# Altium project UltraZohm_Digital_Sensor_Board.PrjPcb (part 1 of 3)
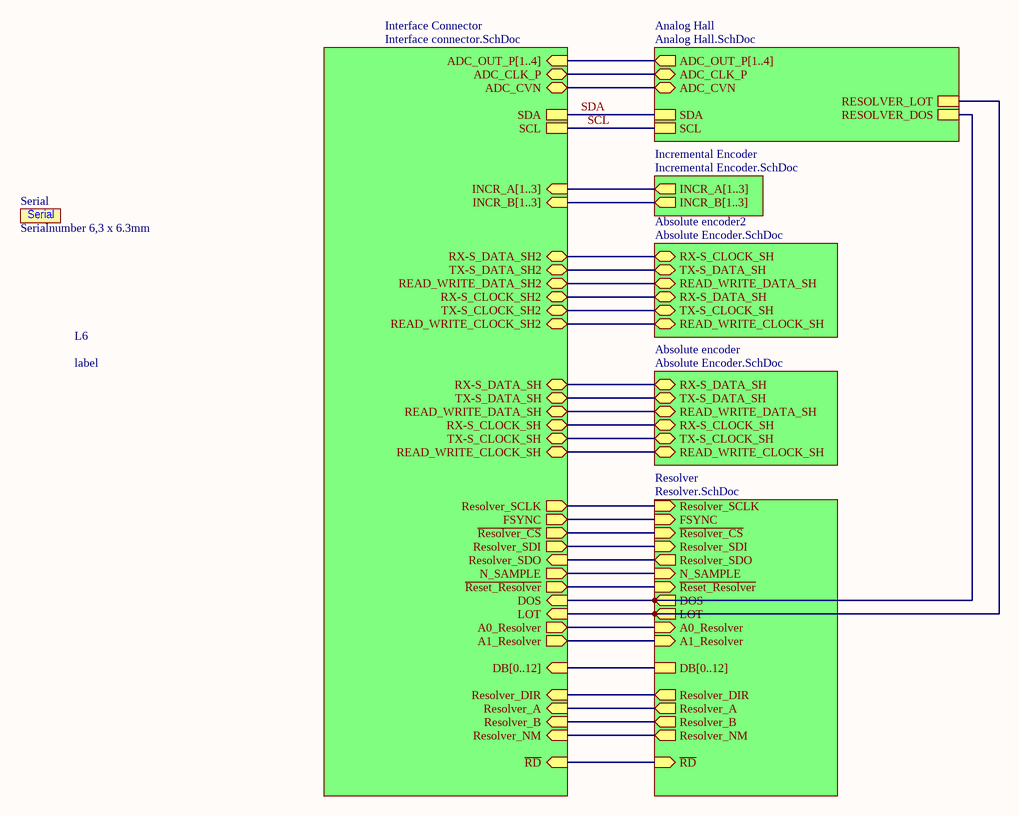
[diagram p0: TopSheet.SchDoc]
ProjectRevision: 2v00; ProjectName: Universal Encoder; Date: 01/12/21; AuthorParam: Julian Klein
16 sheets, 525 parts. Net scope: hierarchical (ports join the sheet entries above them; power ports are global).
Board file: UltraZohm_Digital_Sensor_Board_v1.01.PcbDoc
Sheets:
  TopSheet.SchDoc
    Analog Hall = Analog Hall.SchDoc
      ADC1 = ADC_AH.SchDoc
      ADC2 = ADC_AH.SchDoc
      ADC3 = ADC_AH.SchDoc
      ADC4 = ADC_AH.SchDoc
      Power_Analog Hall = Power Supplies.SchDoc
      GAIN1 = I2CInterface.SchDoc
      GAIN2 = I2CInterface.SchDoc
    Interface Connector = Interface connector.SchDoc
      GF = Goldfinger_Connector.SchDoc
      BS = Busswitch.SchDoc
        Busswitch_B = Busswitch_B.SchDoc
        Busswitch_A = Busswitch_A.SchDoc
        BusswitchControl = I2CInterface.SchDoc
    Absolute encoder = Absolute Encoder.SchDoc
    Resolver = Resolver.SchDoc
      Buffer_EXC = Buffer_EXC.SchDoc
      Impedance Converter = Impedance converter.SchDoc
    Incremental Encoder = Incremental Encoder.SchDoc
      Incre2 = Input Mode Selector.SchDoc
      Incre1 = Input Mode Selector.SchDoc
    Absolute encoder2 = Absolute Encoder.SchDoc

## Sheet TopSheet.SchDoc
size A4; Author: Julian Klein; CompanyName: Technische Hochschule Nürnberg Georg Simon Ohm; Organization: UltraZohm; Address1: Kesslerplatz 12; Address2: 90489 Nürnberg; Address3: GERMANY; DocumentNumber: 1; SheetNumber: 1; SheetTotal: 12; Website: www.ultrazohm.com

### Parts
L6  label  [revisioninfo]
Serial  Serialnumber 6,3 x 6.3mm  [Serial_6.3x6.3mm]  (no BOM)

### Sub-sheets
Absolute encoder = Absolute Encoder.SchDoc: TX-S_DATA_SH (bidir), READ_WRITE_DATA_SH (bidir), RX-S_CLOCK_SH (bidir), RX-S_DATA_SH (bidir), TX-S_CLOCK_SH (bidir), READ_WRITE_CLOCK_SH (bidir)
Absolute encoder2 = Absolute Encoder.SchDoc: TX-S_DATA_SH (bidir), READ_WRITE_DATA_SH (bidir), RX-S_CLOCK_SH (bidir), RX-S_DATA_SH (bidir), TX-S_CLOCK_SH (bidir), READ_WRITE_CLOCK_SH (bidir)
Analog Hall = Analog Hall.SchDoc: ADC_OUT_P[1..4] (out), ADC_CLK_P (bidir), ADC_CVN (bidir), SCL, SDA, RESOLVER_LOT, RESOLVER_DOS
Incremental Encoder = Incremental Encoder.SchDoc: INCR_B[1..3] (out), INCR_A[1..3] (out)
Interface Connector = Interface connector.SchDoc: ADC_CLK_P (bidir), ADC_OUT_P[1..4] (in), ADC_CVN (bidir), TX-S_DATA_SH (bidir), READ_WRITE_DATA_SH (bidir), RX-S_CLOCK_SH (bidir), RX-S_DATA_SH (bidir), TX-S_CLOCK_SH (bidir), READ_WRITE_CLOCK_SH (bidir), INCR_B[1..3] (in), INCR_A[1..3] (in), N_SAMPLE (out), Resolver_SDO (in), Resolver_SDI (out), FSYNC (out), Resolver_SCLK (out), ~{Reset_Resolver} (out), DOS (in), LOT (in), A0_Resolver (out), A1_Resolver (out), Resolver_B (in), Resolver_DIR (in), Resolver_NM (in), Resolver_A (in), ~{Resolver_CS} (out), DB[0..12] (in), READ_WRITE_CLOCK_SH2 (bidir), RX-S_DATA_SH2 (bidir), READ_WRITE_DATA_SH2 (bidir), TX-S_DATA_SH2 (bidir), RX-S_CLOCK_SH2 (bidir), TX-S_CLOCK_SH2 (bidir), SDA, SCL, ~{RD} (in)
Resolver = Resolver.SchDoc: N_SAMPLE (in), Resolver_SDO (out), Resolver_SDI (in), FSYNC (in), Resolver_SCLK (in), ~{Reset_Resolver} (in), DOS (out), LOT (out), A1_Resolver (in), A0_Resolver (in), ~{Resolver_CS} (in), Resolver_B (out), Resolver_DIR (out), Resolver_NM (out), Resolver_A (out), DB[0..12], ~{RD} (in)

### Nets
~{RD}: sheet Interface Connector/~{RD}, sheet Resolver/~{RD}
~{Reset_Resolver}: sheet Interface Connector/~{Reset_Resolver}, sheet Resolver/~{Reset_Resolver}
~{Resolver_CS}: sheet Interface Connector/~{Resolver_CS}, sheet Resolver/~{Resolver_CS}
A: sheet Interface Connector/Resolver_A, sheet Resolver/Resolver_A
ADC_CLK: sheet Analog Hall/ADC_CLK_P, sheet Interface Connector/ADC_CLK_P
ADC_CVN: sheet Analog Hall/ADC_CVN, sheet Interface Connector/ADC_CVN
B: sheet Interface Connector/Resolver_B, sheet Resolver/Resolver_B
DIG_IO_11: sheet Interface Connector/FSYNC, sheet Resolver/FSYNC
DIG_IO_12: sheet Interface Connector/N_SAMPLE, sheet Resolver/N_SAMPLE
DIG_IO_14: sheet Interface Connector/A1_Resolver, sheet Resolver/A1_Resolver
DIG_IO_15: sheet Interface Connector/A0_Resolver, sheet Resolver/A0_Resolver
DIR: sheet Interface Connector/Resolver_DIR, sheet Resolver/Resolver_DIR
DOS: sheet Analog Hall/RESOLVER_DOS, sheet Interface Connector/DOS, sheet Resolver/DOS
LOT: sheet Analog Hall/RESOLVER_LOT, sheet Interface Connector/LOT, sheet Resolver/LOT
NM: sheet Interface Connector/Resolver_NM, sheet Resolver/Resolver_NM
READ_WRITE_CLOCK_SH: sheet Interface Connector/READ_WRITE_CLOCK_SH, sheet Absolute encoder/READ_WRITE_CLOCK_SH
READ_WRITE_DATA_SH: sheet Interface Connector/READ_WRITE_DATA_SH, sheet Absolute encoder/READ_WRITE_DATA_SH
Resolver_SCLK: sheet Interface Connector/Resolver_SCLK, sheet Resolver/Resolver_SCLK
Resolver_SDI: sheet Interface Connector/Resolver_SDI, sheet Resolver/Resolver_SDI
Resolver_SDO: sheet Interface Connector/Resolver_SDO, sheet Resolver/Resolver_SDO
RX-S_CLOCK_SH: sheet Interface Connector/RX-S_CLOCK_SH, sheet Absolute encoder/RX-S_CLOCK_SH
RX-S_DATA_SH: sheet Interface Connector/RX-S_DATA_SH, sheet Absolute encoder/RX-S_DATA_SH
SCL: sheet Analog Hall/SCL, sheet Interface Connector/SCL
SDA: sheet Analog Hall/SDA, sheet Interface Connector/SDA
TX-S_CLOCK_SH: sheet Interface Connector/TX-S_CLOCK_SH, sheet Absolute encoder/TX-S_CLOCK_SH
TX-S_DATA_SH: sheet Interface Connector/TX-S_DATA_SH, sheet Absolute encoder/TX-S_DATA_SH
NetMUX1_3: sheet Interface Connector/RX-S_DATA_SH2, sheet Absolute encoder2/RX-S_CLOCK_SH
NetMUX1_5: sheet Interface Connector/TX-S_DATA_SH2, sheet Absolute encoder2/TX-S_DATA_SH
NetMUX1_7: sheet Interface Connector/READ_WRITE_DATA_SH2, sheet Absolute encoder2/READ_WRITE_DATA_SH
NetMUX1_10: sheet Interface Connector/RX-S_CLOCK_SH2, sheet Absolute encoder2/RX-S_DATA_SH
NetMUX1_12: sheet Interface Connector/TX-S_CLOCK_SH2, sheet Absolute encoder2/TX-S_CLOCK_SH
NetMUX1_14: sheet Interface Connector/READ_WRITE_CLOCK_SH2, sheet Absolute encoder2/READ_WRITE_CLOCK_SH

### Buses and harness runs
bus sheet Analog Hall/ADC_OUT_P[1..4] = sheet Interface Connector/ADC_OUT_P[1..4]
bus sheet Incremental Encoder/INCR_A[1..3] = sheet Interface Connector/INCR_A[1..3]
bus sheet Incremental Encoder/INCR_B[1..3] = sheet Interface Connector/INCR_B[1..3]
bus sheet Interface Connector/DB[0..12] = sheet Resolver/DB[0..12]

### Notes on the sheet
- Title
- Revision:
- Design Engineer:
- Date:
- Project:
- Sheet
- of

### Library data of the parts
Serial = SerialNumber: Created: 2018_09_18_AGeiger; Value: Serialnumber 6,3 x 6.3mm

## Sheet Analog Hall.SchDoc
size A4; Author: Julian Klein; CompanyName: Technische Hochschule Nürnberg Georg Simon Ohm; Organization: UltraZohm; Address1: Kesslerplatz 12; Address2: 90489 Nürnberg; Address3: GERMANY; DocumentNumber: 3; SheetNumber: 3; SheetTotal: 12; Website: www.ultrazohm.com
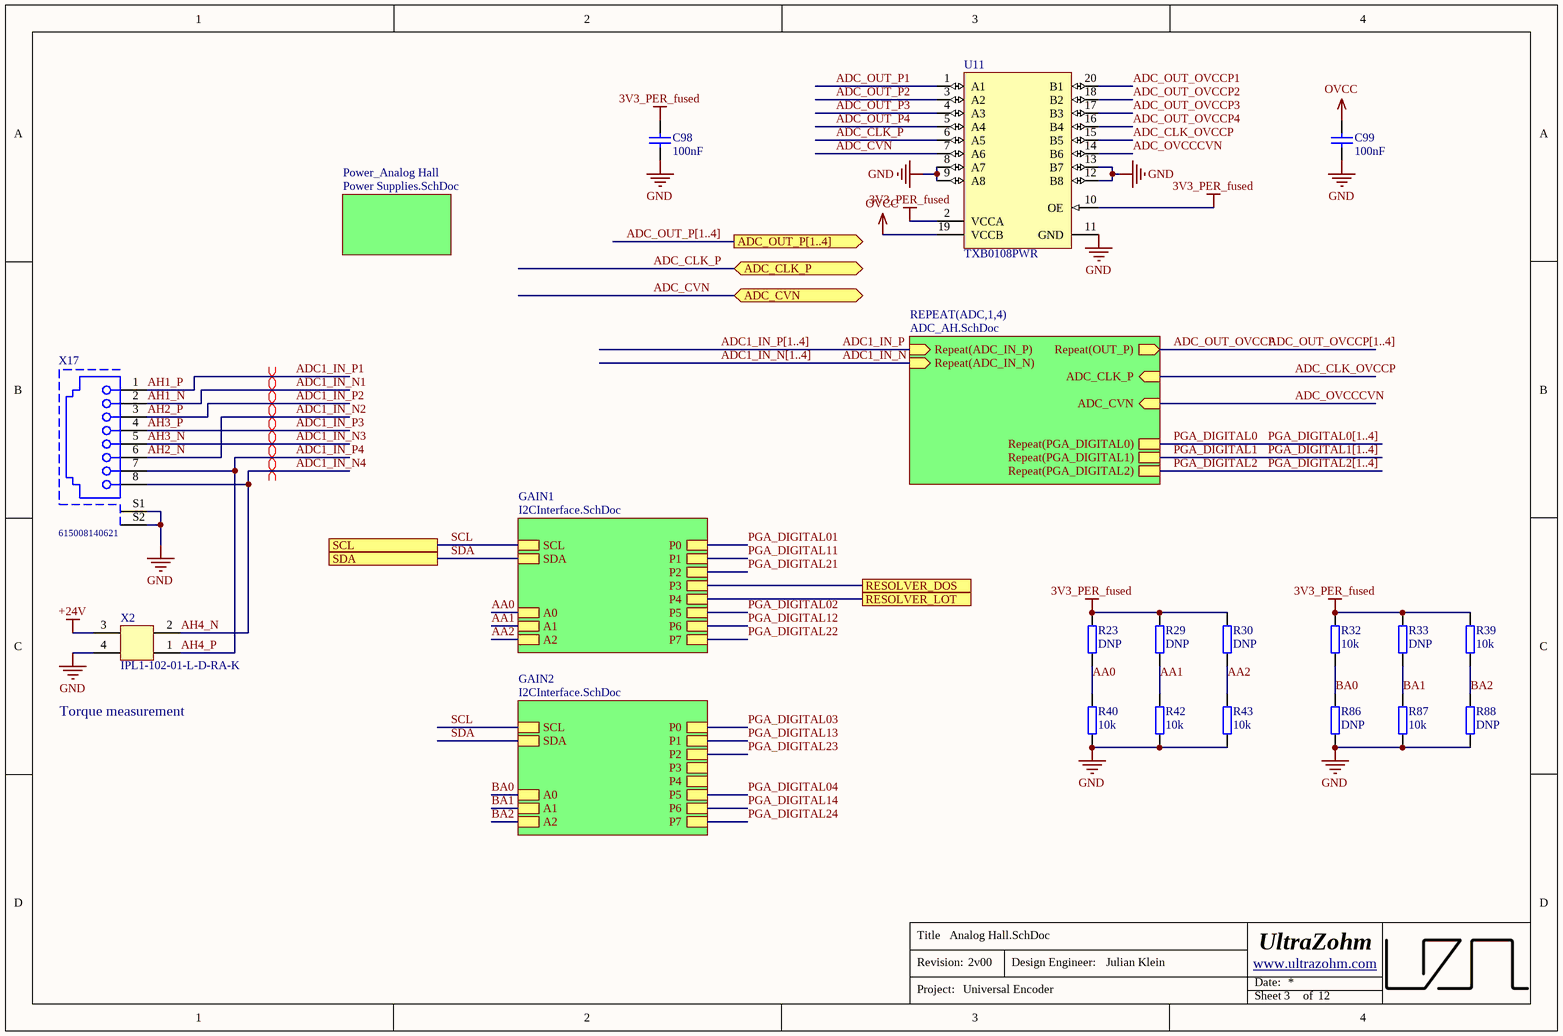
[diagram p1: Analog Hall.SchDoc]

### Parts
C98  100nF  [CAPC1608X07N]
C99  100nF  [CAPC1608X07N]
R23  DNP  [RESC1608X06N]
R29  DNP  [RESC1608X06N]
R30  DNP  [RESC1608X06N]
R32  10k  [RESC1608X06N]
R33  DNP  [RESC1608X06N]
R39  10k  [RESC1608X06N]
R40  10k  [RESC1608X06N]
R42  10k  [RESC1608X06N]
R43  10k  [RESC1608X06N]
R86  DNP  [RESC1608X06N]
R87  10k  [RESC1608X06N]
R88  DNP  [RESC1608X06N]
U11  TXB0108PWR  [PW0020A_L]
X2  IPL1-102-01-L-D-RA-K  [Conector 2x2 TH Horizontal]
X17  615008140621  [615008140621]

### Sub-sheets
GAIN1 = I2CInterface.SchDoc: P4, P7, SDA, P2, P1, A1, A2, P3, P6, SCL, A0, P0, P5
GAIN2 = I2CInterface.SchDoc: P4, P7, SDA, P2, P1, A1, A2, P3, P6, SCL, A0, P0, P5
Power_Analog Hall = Power Supplies.SchDoc: no entries
REPEAT(ADC,1,4) = ADC_AH.SchDoc: Repeat(ADC_IN_N) (in), Repeat(ADC_IN_P) (in), Repeat(OUT_P) (out), ADC_CLK_P (in), ADC_CVN (in), Repeat(PGA_DIGITAL0), Repeat(PGA_DIGITAL1), Repeat(PGA_DIGITAL2)

### Ports
ADC_CLK_P (bidir), ADC_CVN (bidir), ADC_OUT_P[1..4] (out), RESOLVER_DOS, RESOLVER_LOT, SCL, SDA

### Nets
3V3_PER_fused: C98.1 R23.2 R29.2 R30.2 R32.1 R33.1 R39.1 U11.2(VCCA) U11.10(OE)
+24V: X2.3
GND: C98.2 C99.2 R40.1 R42.1 R43.1 R86.2 R87.2 R88.2 U11.8(A7) U11.9(A8) U11.11(GND) U11.12(B8) U11.13(B7) X2.4 X17.S1 X17.S2
OVCC: C99.1 U11.19(VCCB)
AA0: R23.1 R40.2 ; sheet GAIN1/A0  [project net A0]
AA1: R29.1 R42.2 ; sheet GAIN1/A1  [project net A1]
AA2: R30.1 R43.2 ; sheet GAIN1/A2  [project net A2]
ADC1_IN_N: sheet REPEAT(ADC,1,4)/Repeat(ADC_IN_N)
ADC1_IN_N1: X17.2  [also labelled AH1_N]
ADC1_IN_N2: X17.6  [also labelled AH2_N]
ADC1_IN_N3: X17.5  [also labelled AH3_N]
ADC1_IN_N4: X2.2 X17.8  [also labelled AH4_N]
ADC1_IN_P: sheet REPEAT(ADC,1,4)/Repeat(ADC_IN_P)
ADC1_IN_P1: X17.1  [also labelled AH1_P]
ADC1_IN_P2: X17.3  [also labelled AH2_P]
ADC1_IN_P3: X17.4  [also labelled AH3_P]
ADC1_IN_P4: X2.1 X17.7  [also labelled AH4_P]
ADC_CLK_OVCCP: U11.15(B5) ; sheet REPEAT(ADC,1,4)/ADC_CLK_P
ADC_CLK_P: U11.6(A5) ; port ADC_CLK_P  [project net ADC_CLK]
ADC_CVN: U11.7(A6) ; port ADC_CVN
ADC_OUT_OVCCP: sheet REPEAT(ADC,1,4)/Repeat(OUT_P)
ADC_OUT_OVCCP1: U11.20(B1)
ADC_OUT_OVCCP2: U11.18(B2)
ADC_OUT_OVCCP3: U11.17(B3)
ADC_OUT_OVCCP4: U11.16(B4)
ADC_OUT_P1: U11.1(A1)
ADC_OUT_P2: U11.3(A2)
ADC_OUT_P3: U11.4(A3)
ADC_OUT_P4: U11.5(A4)
ADC_OVCCCVN: U11.14(B6) ; sheet REPEAT(ADC,1,4)/ADC_CVN  [project net ADC_CVN]
BA0: R32.2 R86.1 ; sheet GAIN2/A0  [project net A0]
BA1: R33.2 R87.1 ; sheet GAIN2/A1  [project net A1]
BA2: R39.2 R88.1 ; sheet GAIN2/A2  [project net A2]
DOS: port RESOLVER_DOS, sheet GAIN1/P3
LOT: port RESOLVER_LOT, sheet GAIN1/P4
PGA_DIGITAL0: sheet REPEAT(ADC,1,4)/Repeat(PGA_DIGITAL0)
PGA_DIGITAL1: sheet REPEAT(ADC,1,4)/Repeat(PGA_DIGITAL1)
PGA_DIGITAL2: sheet REPEAT(ADC,1,4)/Repeat(PGA_DIGITAL2)
SCL: port SCL, sheet GAIN1/SCL, sheet GAIN2/SCL
SDA: port SDA, sheet GAIN1/SDA, sheet GAIN2/SDA

### Buses and harness runs
bus ADC1_IN_N[1..4]
bus ADC1_IN_P[1..4]
bus ADC_OUT_OVCCP[1..4]
bus ADC_OUT_P[1..4] = port ADC_OUT_P[1..4]
bus PGA_DIGITAL0[1..4]
bus PGA_DIGITAL1[1..4]
bus PGA_DIGITAL2[1..4]

### Layout directives
differential pair: ADC1_IN_N1, ADC1_IN_N2, ADC1_IN_N3, ADC1_IN_N4, ADC1_IN_P1, ADC1_IN_P2, ADC1_IN_P3, ADC1_IN_P4

### Notes on the sheet
- (near X2) Torque measurement
- Title
- Revision:
- Design Engineer:
- Date:
- Project:
- Sheet
- of

### Library data of the parts
C98 = Cap_0603: MPN: 885012206071; MF: Würth; Voltage: 25V; Value: 100nF; Supplier 1: Mouser; Supplier 2: *; Supplier Part Number 1: 710-885012206071; Supplier Part Number 2: *
C99 = Cap_0603: MPN: 885012206071; MF: Würth; Voltage: 16V; Value: 100nF; Supplier 1: Mouser; Supplier 2: *; Supplier Part Number 1: 710-885012206071; Supplier Part Number 2: *
R23 R29 R30 R32 R33 R39 R40 R42 R43 R86-R88 = R_0603: MPN: CRCW06030000Z0EAC; MF: Vishay; Supplier 1: Mouser; Supplier Part Number 1: 71-CRCW06030000Z0EAC
  R23 R29 R30 R33 R86 R88: Value: DNP
  R32 R39 R40 R42 R43 R87: Value: 10k
U11 = CMP-2000-07337-1: TXB0108 8-Bit Bidirectional Voltage-Level Translator with Auto-Direction Sensing and / +/- 15-kV ESD Protection, 1.2 to 3.6 V, -40 to 85 degC, 20-Pin TSSOP (PW), Green (RoHS & no Sb/Br), Tape and Reel; Manufacturer: Texas Instruments; Propagation Delay (Max): 4ns; Logic Function: Translator,Bidirectional; Input Type: Logic; Package Version: 4040064-5/G, 02/2011; Voltage - Supply: 1.2V~3.6V,1.65V~5.5V; Data Rate: 100Mbps; Other Names: 296-21527-6; Number of Channels: 8; Differential - Input: Output:No/No; Number of Outputs/Channel: 1; Product Training Modules: VoltageLevelTranslation; Dynamic Catalog: TXBSeries; Package Reference: PW20; Package Description: 20-Pin Small Outline Package Integrated Circuit, Body 6.5 x 4.4 mm, Pitch 0.65 mm; Category: IntegratedCircuits(ICs); Datasheet URL: http://www.ti.com/general/docs/lit/getliterature.tsp?genericPartNumber=TXB0108&fileType=pdf; Package / Case: 20-TSSOP(0.173",4.40mmWidth); Family: Logic-Translators; Standard Package: 1; Series: -; Manufacturer URL: http://www.ti.com/; Number of Bits: 8; Package URL: http://www.ti.com/litv/pdf/mpds362; Output Type: Logic; Datasheet Version: Rev. F, 12/2014; Packaging: Digi-Reel®; Operating Temperature: -40°C~85°C; Supplier Device Package: 20-TSSOP; Mounting Technology: SurfaceMount
X2 = Conector 2x2 Horizontal: CONN HEADER R/A 4 POS 2.54MM Through Hole; MF: Samtec; Supplier Part Number 2: SAM8823-ND; MPN: IPL1-102-01-L-D-RA-K; Supplier Part Number 1: 200-IPL110201LDRAK; Supplier 1: Mouser; Supplier 2: Digi-Key
X17 = 615008140621: Modular Jack WR-MJ, Tab Up, Shielded, with EMI Panel Finger, Horizontal Entry, THT, 8P8C; Working Voltage: 120VAC; MF: Wurth Elektronik; Compliance: Leadfree/RoHS; Contact Resistance: 20mOhm; Rated Current: 1.5A; Withstanding Voltage: 1000VAC; Port: 1x1; Entrance: Horizontal; Manufacturer URL: http://www.we-online.de; MPN: 615008140621; Mounting Technology: THT; Operating Temperature: -40to85degC; Packaging: Tray; Pin Number: 8P8C; Package Reference: 615008140621; Datasheet URL: https://katalog.we-online.de/em/datasheet/615008140621.pdf; Publisher: WurthElektronik; Supplier Part Number 1: 710-615008140621; Supplier Part Number 2: 732-2742-ND; Supplier 1: Mouser; Supplier 2: Digi-Key

## Sheet ADC_AH.SchDoc
size A4; Author: Julian Klein; CompanyName: Technische Hochschule Nürnberg Georg Simon Ohm; Organization: UltraZohm; Address1: Kesslerplatz 12; Address2: 90489 Nürnberg; Address3: GERMANY; DocumentNumber: 4; SheetNumber: 4; SheetTotal: 12; Website: www.ultrazohm.com
Used 4 times, as channels Analog Hall/ADC1, Analog Hall/ADC2, Analog Hall/ADC3, Analog Hall/ADC4. Parts and nets are listed once, with the designators drawn on the sheet.
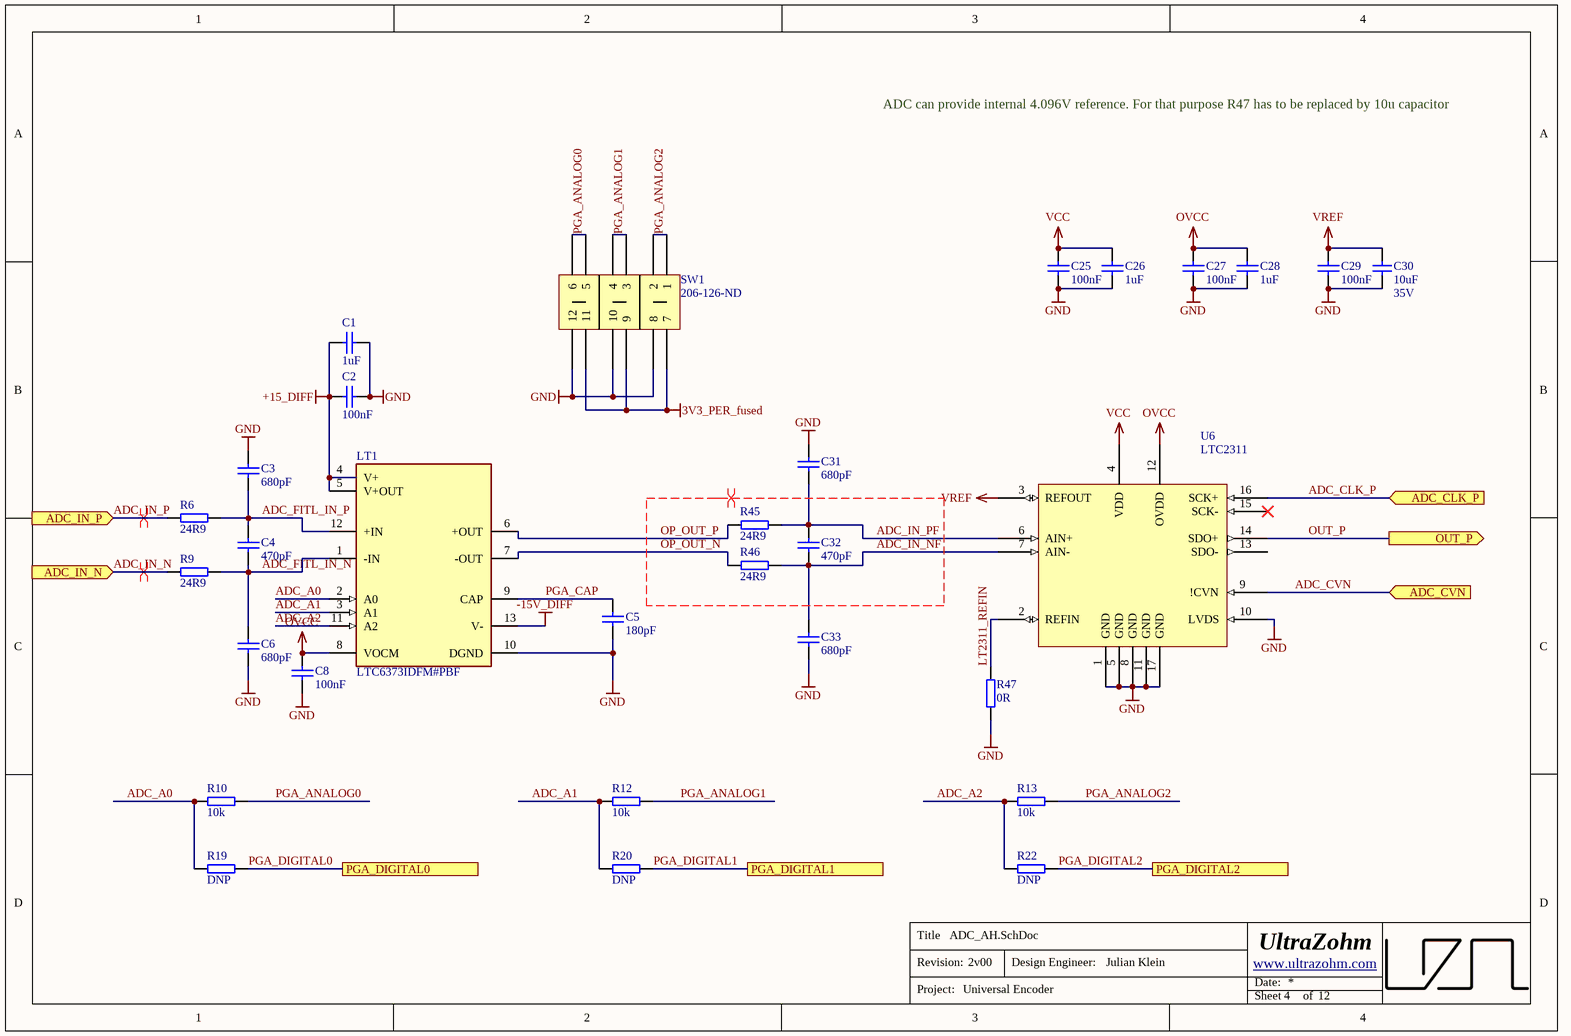
[diagram p2: ADC_AH.SchDoc]

### Parts
C1  1uF  [CAPC1608X07N]
C2  100nF  [CAPC1608X07N]
C3  680pF  [CAPC1608X07N]
C4  470pF  [CAPC1608X07N]
C5  180pF  [CAPC1608X07N]
C6  680pF  [CAPC1608X07N]
C8  100nF  [CAPC1608X07N]
C25  100nF  [CAPC1608X07N]
C26  1uF  [CAPC1608X07N]
C27  100nF  [CAPC1608X07N]
C28  1uF  [CAPC1608X07N]
C29  100nF  [CAPC1608X07N]
C30  10uF  Voltage: 35V  [C_1206]
C31  680pF  [CAPC1608X07N]
C32  470pF  [CAPC1608X07N]
C33  680pF  [CAPC1608X07N]
LT1  LTC6373IDFM#PBF  [FP-LTC6373IDFM#PBF-MFG]
R6  24R9  [RESC1608X06N]
R9  24R9  [RESC1608X06N]
R10  10k  [RESC1608X06N]
R12  10k  [RESC1608X06N]
R13  10k  [RESC1608X06N]
R19  DNP  [RESC1608X06N]
R20  DNP  [RESC1608X06N]
R22  DNP  [RESC1608X06N]
R45  24R9  [RESC1608X06N]
R46  24R9  [RESC1608X06N]
R47  0R  [RESC1608X06N]
SW1  Supplier Part Number 1: 206-126-ND  [206-123]  (hidden comment: 206-126)
U6  LTC2311  [LTC2311-16]

### Ports
ADC_CLK_P (in), ADC_CVN (in), ADC_IN_N (in), ADC_IN_P (in), OUT_P (out), PGA_DIGITAL0, PGA_DIGITAL1, PGA_DIGITAL2

### Nets
3V3_PER_fused: SW1.7 SW1.9 SW1.11
+15_DIFF: C1.1 C2.1 LT1.4(V+) LT1.5(V+OUT)
-15V_DIFF: LT1.13(V-)
GND: C1.2 C2.2 C3.1 C5.2 C6.2 C8.2 C25.2 C26.1 C27.2 C28.1 C29.2 C30.1 C31.1 C33.2 LT1.10(DGND) R47.1 SW1.8 SW1.10 SW1.12 U6.1(GND) U6.5(GND) U6.8(GND) U6.10(LVDS) U6.11(GND) U6.17(GND)
OVCC: C8.1 C27.1 C28.2 LT1.8(VOCM) U6.12(OVDD)
VCC: C25.1 C26.2 U6.4(VDD)
VREF: C29.1 C30.2 U6.3(REFOUT)
ADC_A0: LT1.2(A0) R10.2 R19.2
ADC_A1: LT1.3(A1) R12.2 R20.2
ADC_A2: LT1.11(A2) R13.2 R22.2
ADC_CLK_P: U6.16(SCK+) ; port ADC_CLK_P
ADC_CVN: U6.9(!CVN) ; port ADC_CVN
ADC_FITL_IN_N: C4.2 C6.1 LT1.1(-IN) R9.2
ADC_FITL_IN_P: C3.2 C4.1 LT1.12(+IN) R6.2
ADC_IN_N: R9.1 ; port ADC_IN_N
ADC_IN_NF: C32.2 C33.1 R46.2 U6.7(AIN-)
ADC_IN_P: R6.1 ; port ADC_IN_P
ADC_IN_PF: C31.2 C32.1 R45.2 U6.6(AIN+)
LT2311_REFIN: R47.2 U6.2(REFIN)
OP_OUT_N: LT1.7(-OUT) R46.1
OP_OUT_P: LT1.6(+OUT) R45.1
OUT_P: U6.14(SDO+) ; port OUT_P
PGA_ANALOG0: R10.1 SW1.5 SW1.6
PGA_ANALOG1: R12.1 SW1.3 SW1.4
PGA_ANALOG2: R13.1 SW1.1 SW1.2
PGA_CAP: C5.1 LT1.9(CAP)
PGA_DIGITAL0: R19.1 ; port PGA_DIGITAL0
PGA_DIGITAL1: R20.1 ; port PGA_DIGITAL1
PGA_DIGITAL2: R22.1 ; port PGA_DIGITAL2

Not connected (* = marked no-connect by the designer): U6 13(SDO-) 15(SCK-)*

### Channels
Analog Hall/ADC1: designators end in A; ports ADC_CLK_P=ADC_CLK_OVCCP ADC_CVN=ADC_CVN ADC_IN_N=ADC1_IN_N1 ADC_IN_P=ADC1_IN_P1 OUT_P=ADC_OUT_OVCCP1 PGA_DIGITAL0=P0 PGA_DIGITAL1=P1 PGA_DIGITAL2=P2
Analog Hall/ADC2: designators end in B; ports ADC_CLK_P=ADC_CLK_OVCCP ADC_CVN=ADC_CVN ADC_IN_N=ADC1_IN_N2 ADC_IN_P=ADC1_IN_P2 OUT_P=ADC_OUT_OVCCP2 PGA_DIGITAL0=P5 PGA_DIGITAL1=P6 PGA_DIGITAL2=P7
Analog Hall/ADC3: designators end in C; ports ADC_CLK_P=ADC_CLK_OVCCP ADC_CVN=ADC_CVN ADC_IN_N=ADC1_IN_N3 ADC_IN_P=ADC1_IN_P3 OUT_P=ADC_OUT_OVCCP3 PGA_DIGITAL0=P0 PGA_DIGITAL1=P1 PGA_DIGITAL2=P2
Analog Hall/ADC4: designators end in D; ports ADC_CLK_P=ADC_CLK_OVCCP ADC_CVN=ADC_CVN ADC_IN_N=ADC1_IN_N4 ADC_IN_P=ADC1_IN_P4 OUT_P=ADC_OUT_OVCCP4 PGA_DIGITAL0=P5 PGA_DIGITAL1=P6 PGA_DIGITAL2=P7

### Layout directives
differential pair: ADC1_IN_N1, ADC1_IN_P1, ADC_IN_NF, ADC_IN_PF, OP_OUT_N, OP_OUT_P

### Notes on the sheet
- ADC can provide internal 4.096V reference. For that purpose R47 has to be replaced by 10u capacitor
- Title
- Revision:
- Design Engineer:
- Date:
- Project:
- Sheet
- of

### Library data of the parts
C1 C26 C28 = Cap_0603: MPN: C0603C105K3R; Voltage: 25V; Value: 1uF
C2 C8 C25 C27 C29 = Cap_0603: as C98 on sheet Analog Hall; Value: 100nF; Supplier 1: Mouser; Supplier 2: *; Supplier Part Number 1: 710-885012206071; Supplier Part Number 2: *
C3 C5 C6 C31 C33 = Cap_0603: MPN: VJ0603A681GXJCW1BC; MF: Vishay; Voltage: 16V; Supplier 1: Mouser; Supplier 2: *; Supplier Part Number 1: 77-VJ0603A681GXJCBC; Supplier Part Number 2: *
  C3 C6 C31 C33: Value: 680pF
  C5: Value: 180pF
C4 C32 = Cap_0603: MPN: VJ0603A471GXJPW1BC; MF: Vishay; Voltage: 16V; Value: 470pF; Supplier 1: Mouser; Supplier 2: *; Supplier Part Number 1: 77-VJ0603A471GXJPBC; Supplier Part Number 2: *
C30 = C_1206: Capacitor 1206; MPN: GRM319R6YA106KA12D; Tolerance: 10%; MF: Murata Electronics; Dielectric: X5R; Package: 1206; Value: 10uF; Created: 2018_06_25_AGeiger; Supplier 1: Mouser; Supplier Part Number 1: 81-GRM319R6YA106KA2D
LT1 = CMP-09116-000044-1: INST Amp Single ±18V 12-Pin DFN EP Tube; RoHS Compliant: Yes
R6 R9 R45 R46 = R_0603: MPN: RC0603FR-0724R9L; MF: Yageo; Value: 24R9; Supplier 1: Mouser; Supplier Part Number 1: 603-RC0603FR-0724R9L
R10 R12 R13 R19 R20 R22 R47 = R_0603: MPN: CRCW06030000Z0EAC; MF: Vishay; Supplier 1: Mouser; Supplier Part Number 1: 71-CRCW06030000Z0EAC
  R10 R12 R13: Value: 10k
  R19 R20 R22: Value: DNP
  R47: Value: 0R
SW1 = 206-126: Switch DIP OFF ON SPDT 6 Raised Slide 0.05A 24VDC PC Pins 2.54mm Thru-Hole Tube; Manufacturer: CTS; Body Material: Plastic; Voltage Rating (DC): 24V; Number of Positions: 6; Current Rating: 50mA; Electrical Life: 10000Cycles; Actuator Type: Slide (Standard); Pitch: 0.1inch; Washable: No; Supplier 1: Digi-Key; Manufacturer Part Number: 206-126; RoHS: Yes; Category: DIP Switches; Pricing 1: 1005=1,10898 (USD); Mount: Through Hole; Contact Plating: Gold; Min Operating Temperature: -55°C; Max Operating Temperature: 85°C; Packaging: Rail/Tube; Termination: PC Pin; Package Quantity: 15; Throw Configuration: SPDT; Series: 206; Max Voltage Rating (DC): 24V; Length: 1.286inch; Terminal Pitch: 2.54mm; Radiation Hardening: No; RoHS Compliant: Yes; ComponentLink1URL: https://datasheet.ciiva.com/8677/206-208-8677008.pdf?src-supplier=Avnet; ComponentLink1Description: https://datasheet.ciiva.com/8677/206-208-8677008.pdf?src-supplier=Avnet; ComponentLink2URL: https://datasheet.ciiva.com/12451/206-208-11732-12451385.pdf?src-supplier=Mouser; ComponentLink2Description: https://datasheet.ciiva.com/12451/206-208-11732-12451385.pdf?src-supplier=Mouser
U6 = LTC2311-16: 16 Bit SAR ADC, 5MSps; MPN: LTC2311CMSE-16#PBF; MF: Analog Devices; Package: MSOP-16; Supplier 1: Mouser; Supplier 2: Digi-Key; Supplier Part Number 1: 584-C2311CMSE-16PBF; Supplier Part Number 2: LTC2311CMSE-16#PBF-ND

## Sheet Power Supplies.SchDoc
size 381 x 241 mm; Author: Julian Klein; CompanyName: Technische Hochschule Nürnberg Georg Simon Ohm; Organization: UltraZohm; Address1: Kesslerplatz 12; Address2: 90489 Nürnberg; Address3: GERMANY; DocumentNumber: 6; SheetNumber: 6; SheetTotal: 12; Website: www.ultrazohm.com
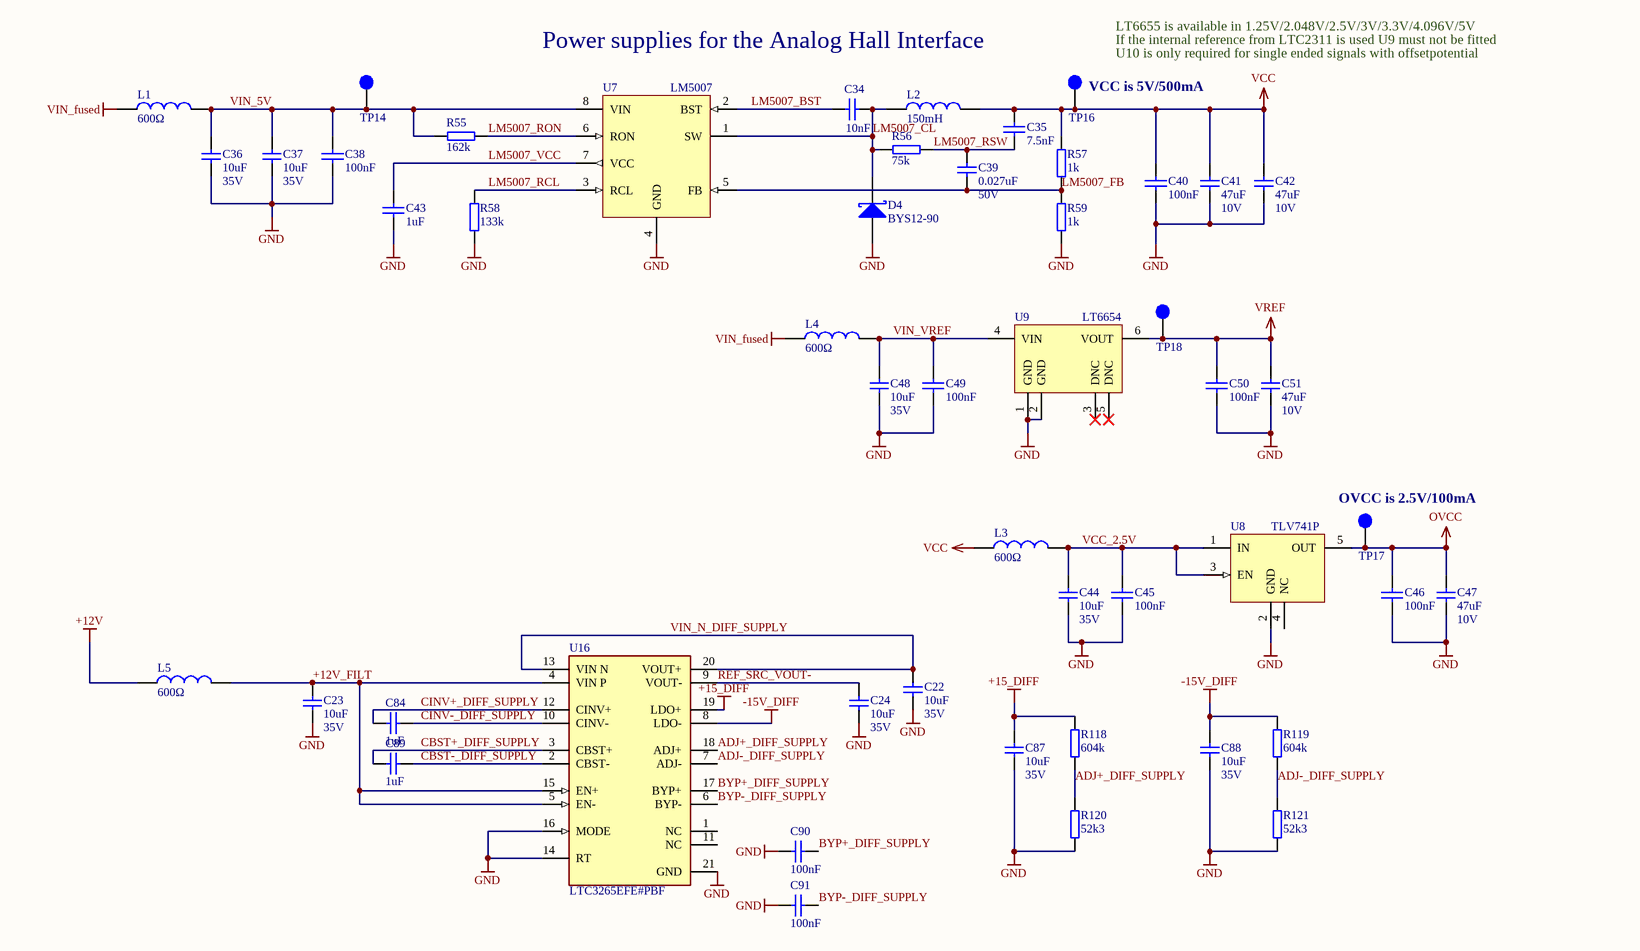
[diagram p3: Power Supplies.SchDoc]

### Parts
C22  10uF  Voltage: 35V  [C_1206]
C23  10uF  Voltage: 35V  [C_1206]
C24  10uF  Voltage: 35V  [C_1206]
C34  10nF  [CAPC1608X07N]
C35  7.5nF  [CAPC1608X07N]
C36  10uF  Voltage: 35V  [C_1206]
C37  10uF  Voltage: 35V  [C_1206]
C38  100nF  [CAPC1608X07N]
C39  0.027uF  Voltage: 50V  [C_1206]
C40  100nF  [CAPC1608X07N]
C41  47uF  Voltage: 10V  [C_1206]
C42  47uF  Voltage: 10V  [C_1206]
C43  1uF  [CAPC1608X07N]
C44  10uF  Voltage: 35V  [C_1206]
C45  100nF  [CAPC1608X07N]
C46  100nF  [CAPC1608X07N]
C47  47uF  Voltage: 10V  [C_1206]
C48  10uF  Voltage: 35V  [C_1206]
C49  100nF  [CAPC1608X07N]
C50  100nF  [CAPC1608X07N]
C51  47uF  Voltage: 10V  [C_1206]
C84  1uF  [CAPC1608X07N]
C87  10uF  Voltage: 35V  [C_1206]
C88  10uF  Voltage: 35V  [C_1206]
C89  1uF  [CAPC1608X07N]
C90  100nF  [CAPC1608X07N]
C91  100nF  [CAPC1608X07N]
D4  BYS12-90  [DIOM4227X23N]
L1  600Ω  [WE-CBF_0805_High Current]
L2  150mH  [SMT_inductor_1050_Performance]
L3  600Ω  [WE-CBF_0805_High Current]
L4  600Ω  [WE-CBF_0805_High Current]
L5  600Ω  [WE-CBF_0805_High Current]
R55  162k  [RESC1608X06N]
R56  75k  [RESC1608X06N]
R57  1k  [RESC1608X06N]
R58  133k  [RESC1608X06N]
R59  1k  [RESC1608X06N]
R118  604k  [RESC1608X06N]
R119  604k  [RESC1608X06N]
R120  52k3  [RESC1608X06N]
R121  52k3  [RESC1608X06N]
TP14  VIN  [TP_1mm]  (value not drawn)
TP16  VCC  [TP_1mm]  (value not drawn)
TP17  OVCC  [TP_1mm]  (value not drawn)
TP18  VREF  [TP_1mm]  (value not drawn)
U7  LM5007  [TSOP65P490X110-8N]
U8  TLV741P  [SOT95P250X110-5N]
U9  LT6654  [SOT95P280X100-6N]
U16  LTC3265EFE#PBF  [FP-FE-20-05-08-1663-MFG]

### Nets
+12V: L5.1
+15_DIFF: C87.2 R118.2 U16.19(LDO+)
-15V_DIFF: C88.2 R119.2 U16.8(LDO-)
GND: C22.1 C23.1 C24.1 C36.1 C37.1 C38.2 C40.1 C41.1 C42.1 C43.1 C44.1 C45.2 C46.2 C47.1 C48.1 C49.2 C50.2 C51.1 C87.1 C88.1 C90.2 C91.2 D4.2(A) R58.1 R59.1 R120.1 R121.1 U7.4(GND) U8.2(GND) U9.1(GND) U9.2(GND) U16.14(RT) U16.16(MODE) U16.21(GND)
OVCC: C46.1 C47.2 TP17.1 U8.5(OUT)
VCC: C35.1 C40.2 C41.2 C42.2 L2.2 L3.1 R57.2 TP16.1
VIN_fused: L1.1 L4.1
VREF: C50.1 C51.2 TP18.1 U9.6(VOUT)
+12V_FILT: C23.2 L5.2 U16.4(VIN_P) U16.5(EN-) U16.15(EN+)
ADJ+_DIFF_SUPPLY: R118.1 R120.2 U16.18(ADJ+)
ADJ-_DIFF_SUPPLY: R119.1 R121.2 U16.7(ADJ-)
BYP+_DIFF_SUPPLY: C90.1 U16.17(BYP+)
BYP-_DIFF_SUPPLY: C91.1 U16.6(BYP-)
CBST+_DIFF_SUPPLY: C89.1 U16.3(CBST+)
CBST-_DIFF_SUPPLY: C89.2 U16.2(CBST-)
CINV+_DIFF_SUPPLY: C84.1 U16.12(CINV+)
CINV-_DIFF_SUPPLY: C84.2 U16.10(CINV-)
LM5007_BST: C34.1 U7.2(BST)
LM5007_CL: C34.2 D4.1(K) L2.1 R56.1 U7.1(SW)
LM5007_FB: C39.1 R57.1 R59.2 U7.5(FB)
LM5007_RCL: R58.2 U7.3(RCL)
LM5007_RON: R55.2 U7.6(RON)
LM5007_RSW: C35.2 C39.2 R56.2
LM5007_VCC: C43.2 U7.7(VCC)
REF_SRC_VOUT-: C24.2 U16.9(VOUT-)
VCC_2.5V: C44.2 C45.1 L3.2 U8.1(IN) U8.3(EN)
VIN_5V: C36.2 C37.2 C38.1 L1.2 R55.1 TP14.1 U7.8(VIN)
VIN_N_DIFF_SUPPLY: C22.2 U16.13(VIN_N) U16.20(VOUT+)
VIN_VREF: C48.2 C49.1 L4.2 U9.4(VIN)

Not connected (* = marked no-connect by the designer): U8 4(NC); U9 3(DNC)* 5(DNC)*; U16 1(NC) 11(NC)

### Notes on the sheet
- (near TP16) Power supplies for the Analog Hall Interface
- LT6655 is available in 1.25V/2.048V/2.5V/3V/3.3V/4.096V/5V
- (near TP16) If the internal reference from LTC2311 is used U9 must not be fitted
- (near TP16) U10 is only required for single ended signals with offsetpotential
- (near TP16) VCC is 5V/500mA
- (near TP17) OVCC is 2.5V/100mA
- Title
- Revision:
- Design Engineer:
- Date:
- Project:
- Sheet
- of

### Library data of the parts
C22-C24 C36 C37 C44 C48 C87 C88 = C_1206: as C30 on sheet ADC_AH; Package: 1206; Value: 10uF; Created: 2018_06_25_AGeiger; Supplier 1: Mouser; Supplier Part Number 1: 81-GRM319R6YA106KA2D
C34 = Cap_0603: MPN: 885012206065; MF: Würth; Voltage: 25V; Value: 10nF; Supplier 1: Mouser; Supplier 2: *; Supplier Part Number 1: 710-885012206065; Supplier Part Number 2: *
C35 = Cap_0603: MPN: C0603C752J3GACTU; MF: KEMET; Voltage: 25V; Value: 7.5nF; Supplier 1: Mouser; Supplier 2: *; Supplier Part Number 1: 80-C0603C752J3GACTU; Supplier Part Number 2: *
C38 C40 C45 C46 C49 C50 C90 C91 = Cap_0603: as C98 on sheet Analog Hall; Value: 100nF; Supplier 1: Mouser; Supplier 2: *; Supplier Part Number 1: 710-885012206071; Supplier Part Number 2: *
C39 = C_1206: Capacitor 1206; MPN: GRM3195C1H273JA01D; Tolerance: 5%; MF: Murata; Dielectric: C0G; Package: 1206; Value: 0.027uF; Created: 2018_06_25_AGeiger; Supplier 1: Mouser; Supplier Part Number 1: 81-GRM315C1H273JA01D
C41 C42 C47 C51 = C_1206: Capacitor 1206; MPN: GRM31CR61A476ME15L; Tolerance: 10%; MF: Murata Electronics; Dielectric: X5R; Package: 1206; Value: 47uF; Created: 2018_06_25_AGeiger; Supplier 1: Mouser; Supplier Part Number 1: 81-GRM31CR61A476ME5L
C43 C84 C89 = Cap_0603: MPN: C0603C105K3R; Voltage: 25V; Value: 1uF
D4 = BYS12-90: Schottky Diode; MPN: BYS12-90-E3/TR3; MF: Vishay; Forward Voltage: 750mV; Reverse Voltage: 90V; Rated Current: 1.5A; Package: DO-214AC; Supplier 1: Farnell; Supplier 2: Mouser; Supplier 3: Digi-Key; Supplier Part Number 1: 2889144; Supplier Part Number 2: 625-BYS12-90-E3/TR3; Supplier Part Number 3: BYS12-90-E3/GICT-ND
L1 L3-L5 = WE-CBF, 742792040: WE-CBF SMD EMI Suppression Ferrite Bead, 0805, 600Ω; MF: Wurth Elektronik; Type: High Current; PublishedDate: Aug 2016; ComponentLink1Description: Manufacturer; ComponentLink1URL: http://www.we-online.de; ComponentLink2Description: Datasheet; ComponentLink2URL: http://katalog.we-online.de/pbs/datasheet/742792040.pdf; MPN: 742792040; Value: 600Ω; Size: 0805; Supplier 1: Farnell; Supplier 2: Mouser; Supplier 3: Digi-Key; Supplier Part Number 1: 2761567; Supplier Part Number 2: 710-742792040; Supplier Part Number 3: 732-1620-1-ND
L2 = B82464G4154M: SMT power Inductor, 150uH, 320m DRC; MF: EPCOS / TDK; Rated Current: 0.85 A; MPN: B82464G4154M; Supplier 1: Mouser; Supplier Part Number 1: 871-B82464G4154M; Value: 150mH; DCR: 320m
R55 = R_0603: MPN: CRCW0603162KFKEA; MF: Vishay; Value: 162k; Supplier 1: Mouser; Supplier Part Number 1: 71-CRCW0603-162K-E3
R56 = R_0603: MPN: RC0603FR-0775KL; MF: Yageo; Value: 75k; Supplier 1: Mouser; Supplier Part Number 1: 603-RC0603FR-0775KL
R57 R59 R118-R121 = R_0603: MPN: RC0603FR-071KL; MF: Yageo; Supplier 1: Mouser; Supplier Part Number 1: 603-RC0603FR-071KL
  R57 R59: Value: 1k
  R118 R119: Value: 604k
  R120 R121: Value: 52k3
R58 = R_0603: MPN: RC0603FR-07133KL; MF: Yageo; Value: 133k; Supplier 1: Mouser; Supplier Part Number 1: 603-RC0603FR-07133KL
TP14 TP16-TP18 = TP_1mm: Testpoint 1mm; Created: 2018_06_25_AGeiger; Value: Testpoint 1mm
U7 = LM5007: Buck Converter, 9-75Vin, 2.5-73Vout; MPN: LM5007MM/NOPB; MF: Texas Instruments; Supplier 1: Farnell; Supplier 2: Mouser; Supplier 3: Digi-Key; Supplier Part Number 1: 9779345; Supplier Part Number 2: 926-LM5007MM/NOPB; Supplier Part Number 3: LM5007MM/NOPBCT-ND; Package: VSSOP-8
U8 = TLV741P: 150mA, 2.5V LDO; MPN: TLV74125PDBVR; MF: Texas Instruments; Supplier 1: Mouser; Supplier 2: Digi-Key; Supplier Part Number 1: 595-TLV74125PDBVR; Supplier Part Number 2: 296-49999-1-ND; Package: SOT-23-5
U9 = LT6654: MPN: LT6654BIS6-5#TRMPBF; MF: Analog Devices; Package: TSOT-23-6; Supplier 1: Farnell; Supplier 2: Mouser; Supplier 3: Digi-Key; Supplier Part Number 1: 2761960; Supplier Part Number 2: 584-6654BIS65TRMPBF; Supplier Part Number 3: LT6654BIS6-5#TRMPBF-ND
U16 = CMP-09139-000006-1: IC REG CHARG PUMP INV DL 20TSSOP; Manufacturer: Analog Devices Inc; Switching Topology: Buck-Boost; Number Of Outputs: 2; Max Junction Temp: +150°C; Output Type: AdjustableProgrammable; Min Supply Voltage: 4.5V; Switching Frequency: 50-500kHz; Max Supply Voltage: 32V; Standoff Height: 0.05mm; Output Voltage: 1.2-32V; Nominal Supply Current: 3-3000uA; Ipc Land Pattern Name: SOP65P640X120-20; Mouser Description: Charge Pump INV/STPUP Automotive 20-Pin TSSOP EP Tube; Manufacturer Part Number: LTC3265EFE#PBF; ComponentLink2Description: Datasheet; Device Class L2: Power Management ICs; Octopart: https://octopart.com/ltc3265efe%23pbf-analog+devices-88944569; Height: 1.2mm; RoHS: TRUE; Category: IC; Digikey Description: IC REG CHARG PUMP INV DL 20TSSOP; ComponentLink2URL: https://www.analog.com/media/en/technical-documentation/data-sheets/3265fa.pdf; Package: FE-20-05-08-1663; Device Class L1: Integrated Circuits (ICs); Temperature Range High: +125°C; Temperature: -40°C to +125°C; Device Class L3: Voltage Regulators - Switching; Automotive: No; Lead Free: Yes; Temperature Range Low: -40°C

## Sheet I2CInterface.SchDoc
size A4; Author: Julian Klein; CompanyName: Technische Hochschule Nürnberg Georg Simon Ohm; Organization: UltraZohm; Address1: Kesslerplatz 12; Address2: 90489 Nürnberg; Address3: GERMANY; DocumentNumber: 12; SheetNumber: 12; SheetTotal: 12; Website: www.ultrazohm.com
Used 3 times, as channels Analog Hall/GAIN1, Analog Hall/GAIN2, Interface Connector/BS/BusswitchControl. Parts and nets are listed once, with the designators drawn on the sheet.
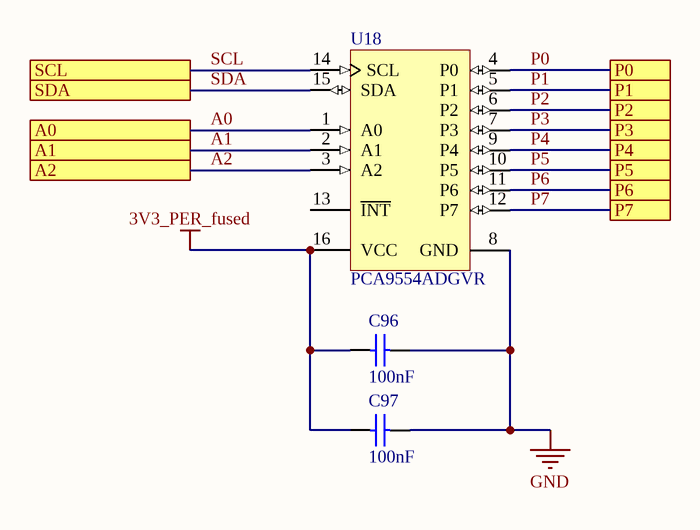
[diagram p4: I2CInterface.SchDoc]

### Parts
C96  100nF  [CAPC1608X07N]
C97  100nF  [CAPC1608X07N]
U18  PCA9554ADGVR  [DGV0016A_L]

### Ports
A0, A1, A2, P0, P1, P2, P3, P4, P5, P6, P7, SCL, SDA

### Nets
3V3_PER_fused: C96.1 C97.1 U18.16(VCC)
GND: C96.2 C97.2 U18.8(GND)
A0: U18.1(A0) ; port A0
A1: U18.2(A1) ; port A1
A2: U18.3(A2) ; port A2
P0: U18.4(P0) ; port P0
P1: U18.5(P1) ; port P1
P2: U18.6(P2) ; port P2
P3: U18.7(P3) ; port P3
P4: U18.9(P4) ; port P4
P5: U18.10(P5) ; port P5
P6: U18.11(P6) ; port P6
P7: U18.12(P7) ; port P7
SCL: U18.14(SCL) ; port SCL
SDA: U18.15(SDA) ; port SDA

Not connected (* = marked no-connect by the designer): U18 13(~{INT})

### Channels
Analog Hall/GAIN1: designators end in A; ports A0=A0 A1=A1 A2=A2 P0=P0 P1=P1 P2=P2 P3=DOS P4=LOT P5=P5 P6=P6 P7=P7 SCL=SCL SDA=SDA
Analog Hall/GAIN2: designators end in B; ports A0=A0 A1=A1 A2=A2 P0=P0 P1=P1 P2=P2 P3=P3_GAIN2 P4=P4_GAIN2 P5=P5 P6=P6 P7=P7 SCL=SCL SDA=SDA
Interface Connector/BS/BusswitchControl: designators end in C; ports A0=A0 A1=A1 A2=A2 P0=P0 P1=P1 P2=P2 P3=P3_BusswitchControl P4=P4_BusswitchControl P5=P5 P6=P6 P7=P7 SCL=SCL SDA=SDA

### Notes on the sheet
- Title
- Revision:
- Design Engineer:
- Date:
- Project:
- Sheet
- of

### Library data of the parts
C96 C97 = Cap_0603: as C98 on sheet Analog Hall; Value: 100nF; Supplier 1: Mouser; Supplier 2: *; Supplier Part Number 1: 710-885012206071; Supplier Part Number 2: *
U18 = CMP-0314-00393-2: Remote 8-Bit I2C and SMBus I/O Expander with Interrupt Output and Configuration Registers, 8 Outputs, 2.3 to 5.5 V, -40 to 85 degC, 16-pin TVSOP (DGV), Green (RoHS & no Sb/Br); Manufacturer: Texas Instruments; No. of Outputs: 8; Push-Pull I/O Type: Yes; VCC(Max)(V): 5.5; Max Frequency(kHz): 400; fSCLK(Max)(MHz): 0.1, 0.4; VCC(Min)(V): 2.3; I2C Address: 0111 xxx; SubFamily: I2C IO Expander; PackageVersion: revE, Aug-2000; Code_JEDEC: MO-194; ComponentLink1Description: Datasheet; PackageDescription: 16-Pin Thin Shrink Small Outline Package 0.4 mm Pitch; ComponentLink1URL: http://www.ti.com/general/docs/lit/getliterature.tsp?genericPartNumber=PCA9554A&fileType=pdf; Configuration Registers: Yes; PartNumber: PCA9554ADGVR; ComponentLink2Description: Package Specification; PackageReference: DGV0016A; Mounting Technology: Surface Mount; Vcc range(V): 2.3 to 5.5; DatasheetVersion: SCPS127D; # of I/Os: 8; 5V Tolerant I/O: Yes; ComponentLink2URL: http://www.ti.com/litv/pdf/msso002e; Interrupt Output: Yes; Eco-Plan: Green (RoHS & no Sb/Br)

## Sheet Interface connector.SchDoc
size A4; Author: Julian Klein; CompanyName: Technische Hochschule Nürnberg Georg Simon Ohm; Organization: UltraZohm; Address1: Kesslerplatz 12; Address2: 90489 Nürnberg; Address3: GERMANY; DocumentNumber: 9; SheetNumber: 9; SheetTotal: 12; Website: www.ultrazohm.com
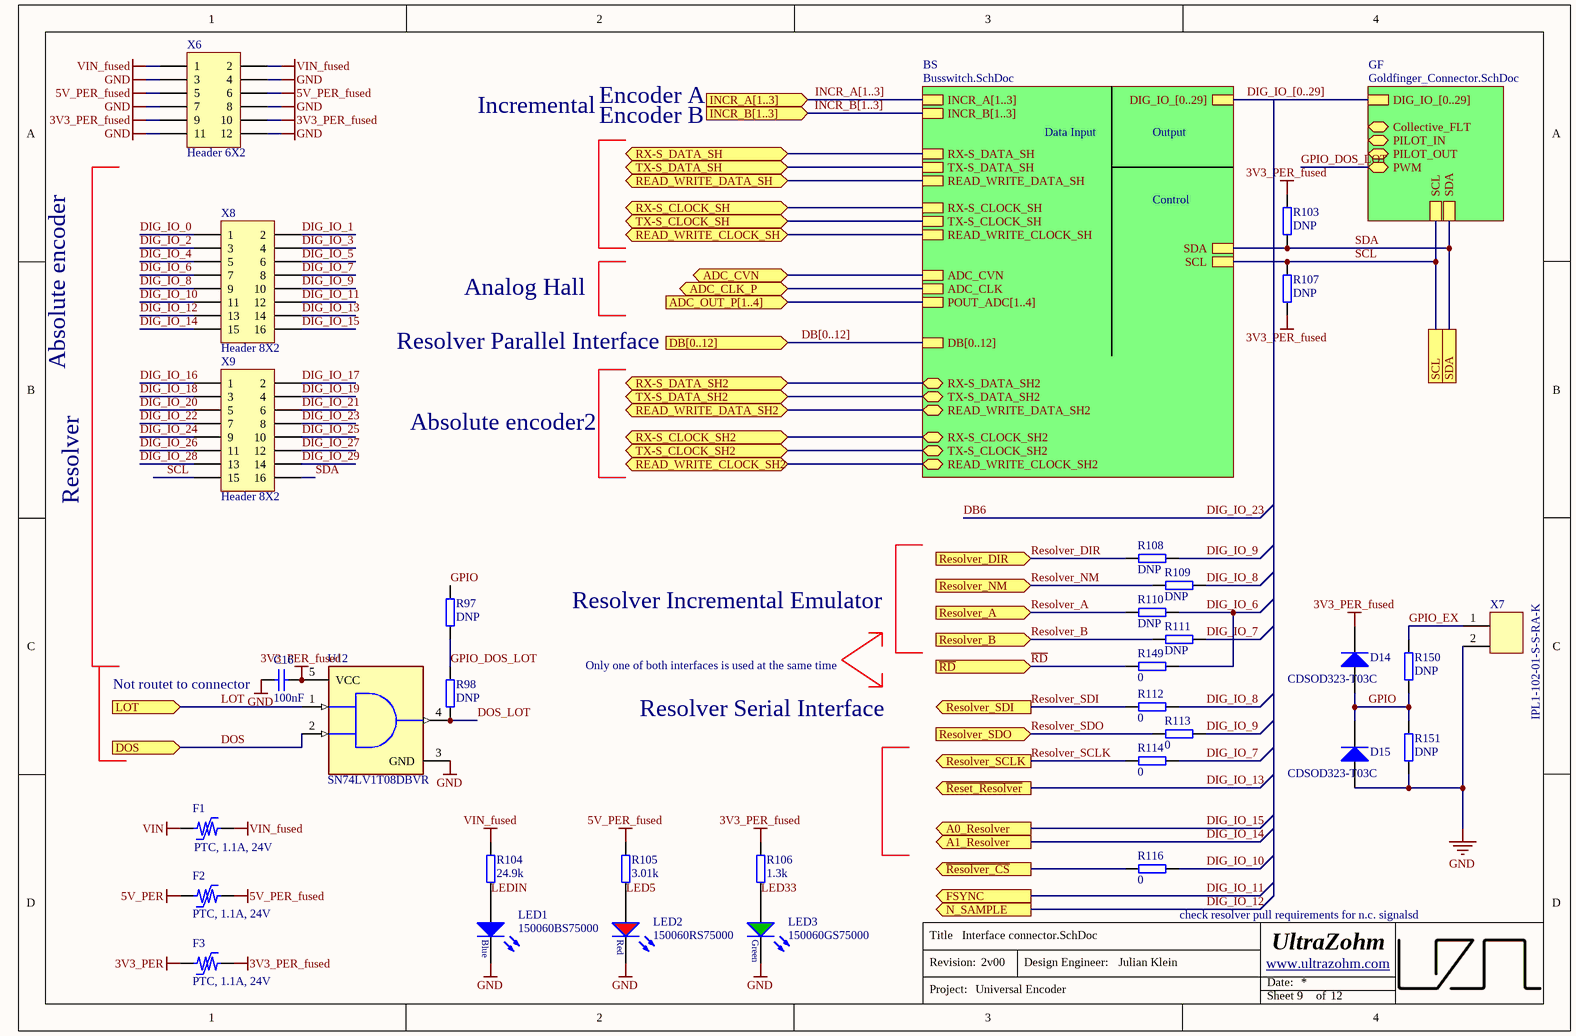
[diagram p5: Interface connector.SchDoc]

### Parts
C16  100nF  [CAPC1608X07N]
D14  CDSOD323-T03C  [SOD-323]
D15  CDSOD323-T03C  [SOD-323]
F1  PTC, 1.1A, 24V  [1812_PTC_Polyfuse_Littelfuse]
F2  PTC, 1.1A, 24V  [1812_PTC_Polyfuse_Littelfuse]
F3  PTC, 1.1A, 24V  [1812_PTC_Polyfuse_Littelfuse]
LED1  150060BS75000  [WL-SMCW_0603]
LED2  150060RS75000  [WL-SMCW_0603]
LED3  150060GS75000  [WL-SMCW_0603]
R97  DNP  [RESC1608X06N]
R98  DNP  [RESC1608X06N]
R103  DNP  [RESC1608X06N]
R104  24.9k  [RESC1608X06N]
R105  3.01k  [RESC1608X06N]
R106  1.3k  [RESC1608X06N]
R107  DNP  [RESC1608X06N]
R108  DNP  [RESC1608X06N]
R109  DNP  [RESC1608X06N]
R110  DNP  [RESC1608X06N]
R111  DNP  [RESC1608X06N]
R112  0  [RESC1608X06N]
R113  0  [RESC1608X06N]
R114  0  [RESC1608X06N]
R116  0  [RESC1608X06N]
R149  0  [RESC1608X06N]
R150  DNP  [RESC1608X06N]
R151  DNP  [RESC1608X06N]
U12  SN74LV1T08DBVR  [FP-DBV0005A-IPC_B]
X6  Header 6X2  [HDR2X6]
X7  IPL1-102-01-S-S-RA-K  [Conector 1x2 TH Horizontal]
X8  Header 8X2  [HDR2X8]
X9  Header 8X2  [HDR2X8]

### Sub-sheets
BS = Busswitch.SchDoc: TX-S_DATA_SH, READ_WRITE_DATA_SH, INCR_B[1..3], POUT_ADC[1..4], ADC_CLK, RX-S_CLOCK_SH, INCR_A[1..3], RX-S_DATA_SH, ADC_CVN, TX-S_CLOCK_SH, DB[0..12], READ_WRITE_CLOCK_SH, DIG_IO_[0..29], TX-S_CLOCK_SH2 (bidir), RX-S_CLOCK_SH2 (bidir), RX-S_DATA_SH2 (bidir), READ_WRITE_DATA_SH2 (bidir), READ_WRITE_CLOCK_SH2 (bidir), TX-S_DATA_SH2 (bidir), SDA, SCL
GF = Goldfinger_Connector.SchDoc: Collective_FLT (bidir), PILOT_IN (bidir), PILOT_OUT (bidir), PWM (bidir), DIG_IO_[0..29], SDA, SCL

### Ports
A0_Resolver (out), A1_Resolver (out), ADC_CLK_P (bidir), ADC_CVN (bidir), ADC_OUT_P[1..4] (in), DB[0..12] (in), DOS (in), FSYNC (out), INCR_A[1..3] (in), INCR_B[1..3] (in), LOT (in), N_SAMPLE (out), READ_WRITE_CLOCK_SH2 (bidir), READ_WRITE_CLOCK_SH (bidir), READ_WRITE_DATA_SH2 (bidir), READ_WRITE_DATA_SH (bidir), Resolver_A (in), Resolver_B (in), Resolver_DIR (in), Resolver_NM (in), Resolver_SCLK (out), Resolver_SDI (out), Resolver_SDO (in), RX-S_CLOCK_SH2 (bidir), RX-S_CLOCK_SH (bidir), RX-S_DATA_SH2 (bidir), RX-S_DATA_SH (bidir), SCL, SDA, TX-S_CLOCK_SH2 (bidir), TX-S_CLOCK_SH (bidir), TX-S_DATA_SH2 (bidir), TX-S_DATA_SH (bidir), ~{RD} (in), ~{Reset_Resolver} (out), ~{Resolver_CS} (out)

### Nets
3V3_PER: F3.1
3V3_PER_fused: C16.2 D14.1(K) F3.2 R103.1 R106.2 R107.2 U12.5(VCC) X6.9 X6.10
5V_PER: F2.1
5V_PER_fused: F2.2 R105.2 X6.5 X6.6
GND: C16.1 D15.2(A) LED1.1(K) LED2.1(K) LED3.1(K) R151.2 U12.3(GND) X6.3 X6.4 X6.7 X6.8 X6.11 X6.12 X7.2
VIN: F1.1
VIN_fused: F1.2 R104.2 X6.1 X6.2
~{RD}: R149.2 ; port ~{RD}
~{Resolver_CS}: R116.2 ; port ~{Resolver_CS}
ADC_CLK: port ADC_CLK_P, sheet BS/ADC_CLK
ADC_CVN: port ADC_CVN, sheet BS/ADC_CVN
DB6: X9.8  [also labelled DIG_IO_23]
DIG_IO_0: X8.1
DIG_IO_1: X8.2
DIG_IO_2: X8.3
DIG_IO_3: X8.4
DIG_IO_4: X8.5
DIG_IO_5: X8.6
DIG_IO_6: R110.1 R149.1 X8.7
DIG_IO_7: R111.1 R114.1 X8.8
DIG_IO_8: R109.1 R112.1 X8.9
DIG_IO_9: R108.1 R113.1 X8.10
DIG_IO_10: R116.1 X8.11
DIG_IO_11: X8.12 ; port FSYNC
DIG_IO_12: X8.13 ; port N_SAMPLE
DIG_IO_13: X8.14 ; port ~{Reset_Resolver}  [project net ~{Reset_Resolver}]
DIG_IO_14: X8.15 ; port A1_Resolver
DIG_IO_15: X8.16 ; port A0_Resolver
DIG_IO_16: X9.1
DIG_IO_17: X9.2
DIG_IO_18: X9.3
DIG_IO_19: X9.4
DIG_IO_20: X9.5
DIG_IO_21: X9.6
DIG_IO_22: R97.2 R98.1 X9.7 ; sheet GF/PWM  [also labelled GPIO_DOS_LOT]
DIG_IO_24: X9.9
DIG_IO_25: X9.10
DIG_IO_26: X9.11
DIG_IO_27: X9.12
DIG_IO_28: X9.13
DIG_IO_29: X9.14
DOS: U12.2(B) ; port DOS
DOS_LOT: R98.2 U12.4(Y)
GPIO: D14.2(A) D15.1(K) R97.1 R150.2 R151.1
GPIO_EX: R150.1 X7.1
LED5: LED2.2(A) R105.1
LED33: LED3.2(A) R106.1
LEDIN: LED1.2(A) R104.1
LOT: U12.1(A) ; port LOT
READ_WRITE_CLOCK_SH: port READ_WRITE_CLOCK_SH, sheet BS/READ_WRITE_CLOCK_SH
READ_WRITE_DATA_SH: port READ_WRITE_DATA_SH, sheet BS/READ_WRITE_DATA_SH
Resolver_A: R110.2 ; port Resolver_A  [project net A]
Resolver_B: R111.2 ; port Resolver_B  [project net B]
Resolver_DIR: R108.2 ; port Resolver_DIR  [project net DIR]
Resolver_NM: R109.2 ; port Resolver_NM  [project net NM]
Resolver_SCLK: R114.2 ; port Resolver_SCLK
Resolver_SDI: R112.2 ; port Resolver_SDI
Resolver_SDO: R113.2 ; port Resolver_SDO
RX-S_CLOCK_SH: port RX-S_CLOCK_SH, sheet BS/RX-S_CLOCK_SH
RX-S_DATA_SH: port RX-S_DATA_SH, sheet BS/RX-S_DATA_SH
SCL: R107.1 X9.15 ; port SCL, sheet GF/SCL, sheet BS/SCL
SDA: R103.2 X9.16 ; port SDA, sheet GF/SDA, sheet BS/SDA
TX-S_CLOCK_SH: port TX-S_CLOCK_SH, sheet BS/TX-S_CLOCK_SH
TX-S_DATA_SH: port TX-S_DATA_SH, sheet BS/TX-S_DATA_SH
NetMUX1_3: port RX-S_DATA_SH2, sheet BS/RX-S_DATA_SH2
NetMUX1_5: port TX-S_DATA_SH2, sheet BS/TX-S_DATA_SH2
NetMUX1_7: port READ_WRITE_DATA_SH2, sheet BS/READ_WRITE_DATA_SH2
NetMUX1_10: port RX-S_CLOCK_SH2, sheet BS/RX-S_CLOCK_SH2
NetMUX1_12: port TX-S_CLOCK_SH2, sheet BS/TX-S_CLOCK_SH2
NetMUX1_14: port READ_WRITE_CLOCK_SH2, sheet BS/READ_WRITE_CLOCK_SH2

### Buses and harness runs
bus DB[0..12] = port DB[0..12] = sheet BS/DB[0..12]
bus DIG_IO_[0..29] = sheet BS/DIG_IO_[0..29] = sheet GF/DIG_IO_[0..29]
bus INCR_A[1..3] = port INCR_A[1..3] = sheet BS/INCR_A[1..3]
bus INCR_B[1..3] = port INCR_B[1..3] = sheet BS/INCR_B[1..3]
bus port ADC_OUT_P[1..4] = sheet BS/POUT_ADC[1..4]

### Notes on the sheet
- Incremental
- Encoder A
- Encoder B
- Data Input
- Output
- Control
- Analog Hall
- Absolute encoder
- Resolver Parallel Interface
- Absolute encoder2
- Resolver
- Resolver Incremental Emulator
- (near C16) Not routet to connector
- Only one of both interfaces is used at the same time
- Resolver Serial Interface
- (near R116) check resolver pull requirements for n.c. signalsd
- Title
- Revision:
- Design Engineer:
- Date:
- Project:
- Sheet
- of

### Library data of the parts
C16 = Cap_0603: as C98 on sheet Analog Hall; Value: 100nF; Supplier 1: Mouser; Supplier 2: *; Supplier Part Number 1: 710-885012206071; Supplier Part Number 2: *
D14 D15 = Diodo TVS: TVS DIODE 3.3V 19V SOD323; MF: Bourns; Supplier Part Number 2: CDSOD323-T03CCT-ND; MPN: CDSOD323-T03C; Supplier Part Number 1: 652-CDSOD323-T03C; Package: SOD-323-2; Supplier 2: Digi-Key; Supplier 1: Mouser
F1-F3 = Littelfuse_PTC_1812: Resettable PTC Polyfuse SMD, 1812, automotive; MPN: miniASMDC110F/24; Trip Current: 2.2A; Resistance: 0.18Ohm; MF: Littelfuse; Created: 2019_02_10_AGeiger; Package: 1812; ComponentLink1URL: https://www.littelfuse.com/~/media/electronics/datasheets/resettable_ptcs/littelfuse_ptc_surface_mount_catalog_datasheet.pdf.pdf; ComponentLink1Description: Datasheet; Value: PTC, 1.1A, 24V; Voltage: 24V; Hold Current: 1.1A
LED1 = LED_Blue_0603: WL-SMCW SMD Mono-color Chip LED Waterclear, size 0603, Blue, 3.2 V, 140°; Forward Voltage: 3.2 V; Luminous Intensity: 145 mcd; Peak Wavelength: 465 nm; Dominant Wavelength: 470 nm; MF: Wuerth Elektronik; Published Date: Sep. 2017; ComponentLink1Description: Manufacturer; ComponentLink1URL: http://www.we-online.de; ComponentLink2Description: Datasheet; ComponentLink2URL: http://katalog.we-online.com/led/datasheet/150060BS75000.pdf; MPN: 150060BS75000; Size: 0603; Viewing Angle: 140°; Emitting Color: Blue; Value: 150060BS75000; Package: 0603; Created: 2018_09_06_AGeiger; Supplier 1: Farnell; Supplier Part Number 1: 2322069; Supplier 2: Mouser; Supplier Part Number 2: 710-150060BS75000; Supplier 3: Digi-Key; Supplier Part Number 3: 732-4966-1-ND
LED2 = LED_Red_0603: WL-SMCW SMD Mono-color Chip LED Waterclear, size 0603, Red, 2 V, 140°; Forward Voltage: 2 V; Luminous Intensity: 250 mcd; Peak Wavelength: 630 nm; Dominant Wavelength: 625 nm; MF: Wuerth Elektronik; Published Date: Sep. 2017; ComponentLink1Description: Manufacturer; ComponentLink1URL: http://www.we-online.de; ComponentLink2Description: Datasheet; ComponentLink2URL: http://katalog.we-online.com/led/datasheet/150060RS75000.pdf; MPN: 150060RS75000; Size: 0603; Viewing Angle: 140°; Emitting Color: Red; Value: 150060RS75000; Package: 0603; Created: 2018_09_06_AGeiger; Supplier 1: Farnell; Supplier Part Number 1: 2322071; Supplier 2: Mouser; Supplier Part Number 2: 710-150060RS75000; Supplier 3: Digi-Key; Supplier Part Number 3: 732-4978-1-ND
LED3 = LED_Green_0603: WL-SMCW SMD Mono-color Chip LED Waterclear, size 0603, Green, 3.2 V, 140°; Forward Voltage: 3.2 V; Luminous Intensity: 430 mcd; Peak Wavelength: 515 nm; Dominant Wavelength: 520 nm; MF: Wuerth Elektronik; Published Date: Sep. 2017; ComponentLink1Description: Manufacturer; ComponentLink1URL: http://www.we-online.de; ComponentLink2Description: Datasheet; ComponentLink2URL: http://katalog.we-online.com/led/datasheet/150060GS75000.pdf; MPN: 150060GS75000; Size: 0603; Viewing Angle: 140°; Emitting Color: Green; Value: 150060GS75000; Package: 0603; Created: 2018_09_06_AGeiger; Supplier 1: Farnell; Supplier Part Number 1: 2322070; Supplier 2: Mouser; Supplier Part Number 2: 710-150060GS75000; Supplier 3: Digi-Key; Supplier Part Number 3: 732-4971-1-ND
R97 R98 R150 R151 = R_0603: Value: DNP; MF: *; MPN: *; Supplier 1: *; Supplier Part Number 1: *
R103-R114 R116 = R_0603: MPN: CRCW060324K9FKEAC; MF: Vishay / Dale; Supplier 1: Mouser; Supplier Part Number 1: 71-CRCW060324K9FKEAC; Package: 0603
  R103 R107-R111: Value: DNP
  R104: Value: 24.9k
  R105: Value: 3.01k
  R106: Value: 1.3k
  R112-R114 R116: Value: 0
R149 = R_0603: MPN: CRCW060324K9FKEAC; Value: DNP; MF: Vishay / Dale; Supplier 1: Mouser; Supplier Part Number 1: 71-CRCW060324K9FKEAC; Package: 0603
U12 = CMP-0859-00119-4: IC GATE AND 1CH 2-INP SOT23-5; Quiescent Current: 1uA; Logic Function: AND GATE; Number of Inputs: 2; Number of Circuits: 1; Min Supply Voltage: 1.6V; High Level Output Current: -8mA; Max Supply Voltage: 5.5V; Low Level Output Current: 8mA; Propagation Delay: 7ns; Packaging: Tape and Reel; Number of Pins: 5; Min Operating Temperature: -40°C; Radiation Hardening: No; Package Quantity: 3000; Weight: 0.000557oz; Height: 1.45mm; RoHS Compliant: Yes; Length: 3.05mm; Number of Bits: 1; Width: 1.75mm; Number of Gates: 1; Max Operating Temperature: 125°C; Mount: Surface Mount; Case/Package: SOT-23-5; Lead Free: Lead Free; Number of Input Lines: 2
X6 = Header 6X2: Header, 6-Pin, Dual row; LatestRevisionDate: 17-Jul-2002; LatestRevisionNote: Re-released for DXP Platform.; Publisher: Altium Limited
X7 = Conector 1x2 Horizontal: CONN HEADER R/A 2POS 2.54MM Through Hole; MF: Samtec; Supplier Part Number 2: SAM12667-ND; MPN: IPL1-102-01-S-S-RA-K; Supplier Part Number 1: 200-IPL110201SSRAK; Supplier 1: Mouser; Supplier 2: Digi-Key
X8 X9 = Header 8X2: Header, 8-Pin, Dual row; LatestRevisionDate: 17-Jul-2002; LatestRevisionNote: Re-released for DXP Platform.; Publisher: Altium Limited

## Sheet Goldfinger_Connector.SchDoc
size A4; Author: Julian Klein; CompanyName: Technische Hochschule Nürnberg Georg Simon Ohm; Organization: UltraZohm; Address1: Kesslerplatz 12; Address2: 90489 Nürnberg; Address3: GERMANY; DocumentNumber: 12; SheetNumber: 12; SheetTotal: 12; Website: www.ultrazohm.com
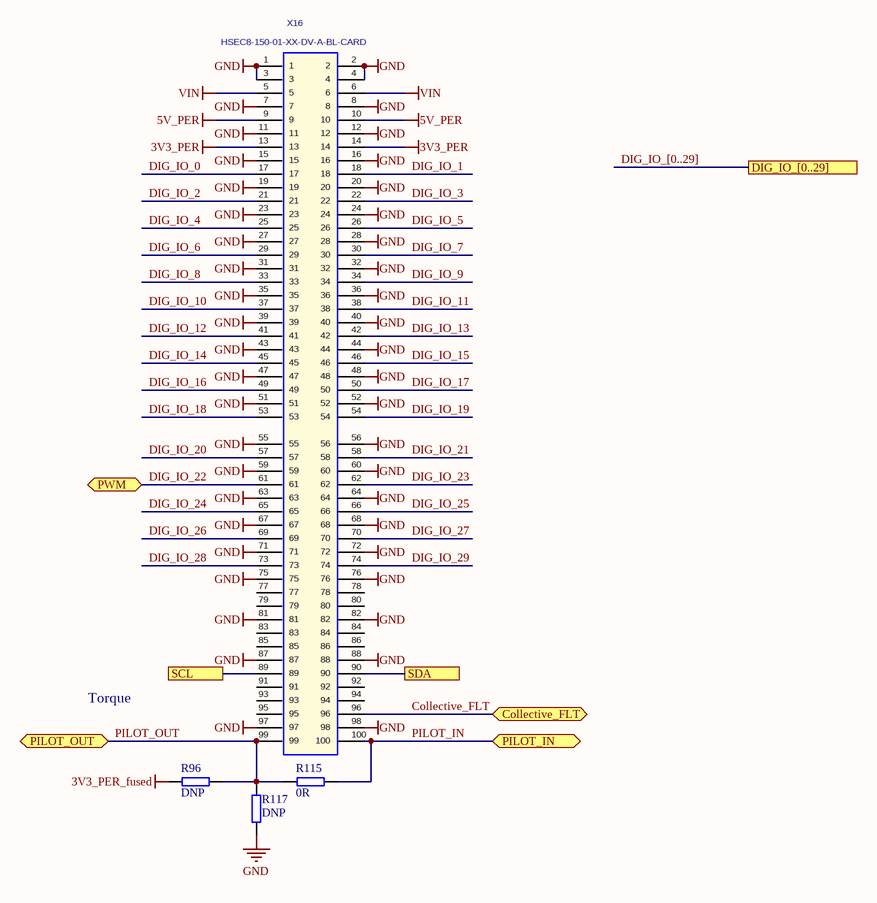
[diagram p6: Goldfinger_Connector.SchDoc]

### Parts
R96  DNP  [RESC1608X06N]
R115  0R  [RESC1608X06N]
R117  DNP  [RESC1608X06N]
X16  HSEC8-150-01-XX-DV-A-BL-CARD  [HSEC8-150-01-XX-DV-A-BL-CARD]  (no BOM)

### Ports
Collective_FLT (bidir), DIG_IO_[0..29], PILOT_IN (bidir), PILOT_OUT (bidir), PWM (bidir), SCL, SDA

### Nets
3V3_PER: X16.13 X16.14
3V3_PER_fused: R96.2
5V_PER: X16.9 X16.10
GND: R117.1 X16.1 X16.2 X16.3 X16.4 X16.7 X16.8 X16.11 X16.12 X16.15 X16.16 X16.19 X16.20 X16.23 X16.24 X16.27 X16.28 X16.31 X16.32 X16.35 X16.36 X16.39 X16.40 X16.43 X16.44 X16.47 X16.48 X16.51 X16.52 X16.55 X16.56 X16.59 X16.60 X16.63 X16.64 X16.67 X16.68 X16.71 X16.72 X16.75 X16.76 X16.81 X16.82 X16.87 X16.88 X16.97 X16.98
VIN: X16.5 X16.6
Collective_FLT: X16.96 ; port Collective_FLT
DIG_IO_0: X16.17
DIG_IO_1: X16.18
DIG_IO_2: X16.21
DIG_IO_3: X16.22
DIG_IO_4: X16.25
DIG_IO_5: X16.26
DIG_IO_6: X16.29
DIG_IO_7: X16.30
DIG_IO_8: X16.33
DIG_IO_9: X16.34
DIG_IO_10: X16.37
DIG_IO_11: X16.38
DIG_IO_12: X16.41
DIG_IO_13: X16.42  [project net ~{Reset_Resolver}]
DIG_IO_14: X16.45
DIG_IO_15: X16.46
DIG_IO_16: X16.49
DIG_IO_17: X16.50
DIG_IO_18: X16.53
DIG_IO_19: X16.54
DIG_IO_20: X16.57
DIG_IO_21: X16.58
DIG_IO_22: X16.61 ; port PWM
DIG_IO_23: X16.62  [project net DB6]
DIG_IO_24: X16.65
DIG_IO_25: X16.66
DIG_IO_26: X16.69
DIG_IO_27: X16.70
DIG_IO_28: X16.73
DIG_IO_29: X16.74
PILOT_IN: R115.2 X16.100 ; port PILOT_IN
PILOT_OUT: R96.1 R115.1 R117.2 X16.99 ; port PILOT_OUT
SCL: X16.89 ; port SCL
SDA: X16.90 ; port SDA

Not connected (* = marked no-connect by the designer): X16 77 78 79 80 83 84 85 86 91 92 93 94 95

### Buses and harness runs
bus DIG_IO_[0..29] = port DIG_IO_[0..29]

### Notes on the sheet
- Torque
- Title
- Revision:
- Design Engineer:
- Date:
- Project:
- Sheet
- of

### Library data of the parts
R96 R115 R117 = R_0603: MPN: CRCW06030000Z0EAC; MF: Vishay; Supplier 1: Mouser; Supplier Part Number 1: 71-CRCW06030000Z0EAC
  R96 R117: Value: DNP
  R115: Value: 0R
X16 = HSEC8-150-01-XX-DV-A-BL-CARD: Mating Card Layout for HSEC8-150-01-XX-DV-A-BL; Manufacturer: SAMTEC; Created: 2018_04_23_AGeiger; Value: HSEC8-150-01-XX-DV-A-BL-CARD

## Sheet Busswitch.SchDoc
size A4; Author: Julian Klein; CompanyName: Technische Hochschule Nürnberg Georg Simon Ohm; Organization: UltraZohm; Address1: Kesslerplatz 12; Address2: 90489 Nürnberg; Address3: GERMANY; DocumentNumber: 12; SheetNumber: 12; SheetTotal: 12; Website: www.ultrazohm.com
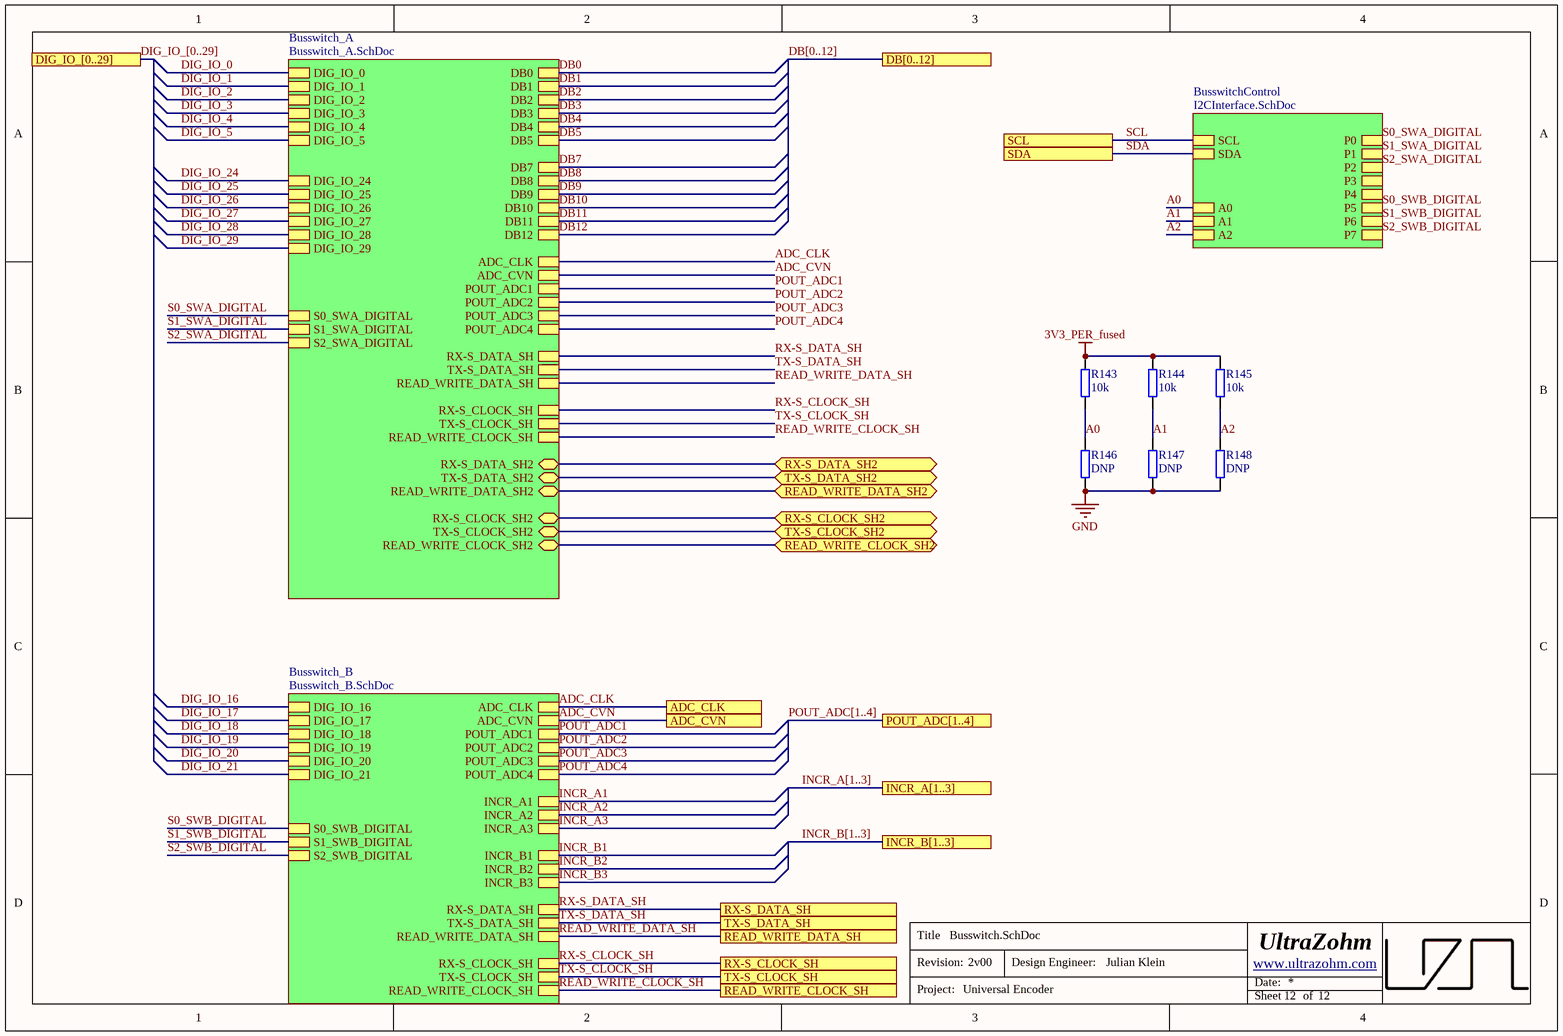
[diagram p7: Busswitch.SchDoc]

### Parts
R143  10k  [RESC1608X06N]
R144  10k  [RESC1608X06N]
R145  10k  [RESC1608X06N]
R146  DNP  [RESC1608X06N]
R147  DNP  [RESC1608X06N]
R148  DNP  [RESC1608X06N]

### Sub-sheets
Busswitch_A = Busswitch_A.SchDoc: DIG_IO_29, DIG_IO_4, DIG_IO_0, DIG_IO_26, DIG_IO_25, DIG_IO_2, DIG_IO_3, DIG_IO_28, DIG_IO_5, DIG_IO_24, DIG_IO_27, DIG_IO_1, DB9, DB12, DB10, DB4, DB8, DB7, DB5, DB11, DB3, DB1, DB2, DB0, POUT_ADC1, ADC_CLK, ADC_CVN, POUT_ADC2, POUT_ADC4, POUT_ADC3, RX-S_DATA_SH, READ_WRITE_CLOCK_SH, TX-S_CLOCK_SH, TX-S_DATA_SH, RX-S_CLOCK_SH, READ_WRITE_DATA_SH, RX-S_DATA_SH2 (bidir), TX-S_DATA_SH2 (bidir), READ_WRITE_CLOCK_SH2 (bidir), TX-S_CLOCK_SH2 (bidir), RX-S_CLOCK_SH2 (bidir), READ_WRITE_DATA_SH2 (bidir), S2_SWA_DIGITAL, S1_SWA_DIGITAL, S0_SWA_DIGITAL
Busswitch_B = Busswitch_B.SchDoc: POUT_ADC4, INCR_A1, READ_WRITE_DATA_SH, INCR_B1, POUT_ADC1, POUT_ADC2, INCR_A3, INCR_A2, TX-S_CLOCK_SH, READ_WRITE_CLOCK_SH, RX-S_CLOCK_SH, INCR_B3, POUT_ADC3, ADC_CLK, INCR_B2, ADC_CVN, TX-S_DATA_SH, RX-S_DATA_SH, DIG_IO_18, DIG_IO_21, DIG_IO_20, DIG_IO_19, DIG_IO_16, DIG_IO_17, S2_SWB_DIGITAL, S1_SWB_DIGITAL, S0_SWB_DIGITAL
BusswitchControl = I2CInterface.SchDoc: P4, P7, SDA, P2, P1, A1, A2, P3, P6, SCL, A0, P0, P5

### Ports
ADC_CLK, ADC_CVN, DB[0..12], DIG_IO_[0..29], INCR_A[1..3], INCR_B[1..3], POUT_ADC[1..4], READ_WRITE_CLOCK_SH, READ_WRITE_CLOCK_SH2 (bidir), READ_WRITE_DATA_SH, READ_WRITE_DATA_SH2 (bidir), RX-S_CLOCK_SH, RX-S_CLOCK_SH2 (bidir), RX-S_DATA_SH, RX-S_DATA_SH2 (bidir), SCL, SDA, TX-S_CLOCK_SH, TX-S_CLOCK_SH2 (bidir), TX-S_DATA_SH, TX-S_DATA_SH2 (bidir)

### Nets
3V3_PER_fused: R143.1 R144.1 R145.1
GND: R146.2 R147.2 R148.2
A0: R143.2 R146.1 ; sheet BusswitchControl/A0
A1: R144.2 R147.1 ; sheet BusswitchControl/A1
A2: R145.2 R148.1 ; sheet BusswitchControl/A2
ADC_CLK: port ADC_CLK, sheet Busswitch_B/ADC_CLK, sheet Busswitch_A/ADC_CLK
ADC_CVN: port ADC_CVN, sheet Busswitch_B/ADC_CVN, sheet Busswitch_A/ADC_CVN
POUT_ADC1: sheet Busswitch_B/POUT_ADC1, sheet Busswitch_A/POUT_ADC1  [project net ADC_OUT_P1]
POUT_ADC2: sheet Busswitch_B/POUT_ADC2, sheet Busswitch_A/POUT_ADC2  [project net ADC_OUT_P2]
POUT_ADC3: sheet Busswitch_B/POUT_ADC3, sheet Busswitch_A/POUT_ADC3  [project net ADC_OUT_P3]
POUT_ADC4: sheet Busswitch_B/POUT_ADC4, sheet Busswitch_A/POUT_ADC4  [project net ADC_OUT_P4]
READ_WRITE_CLOCK_SH: port READ_WRITE_CLOCK_SH, sheet Busswitch_B/READ_WRITE_CLOCK_SH, sheet Busswitch_A/READ_WRITE_CLOCK_SH
READ_WRITE_DATA_SH: port READ_WRITE_DATA_SH, sheet Busswitch_B/READ_WRITE_DATA_SH, sheet Busswitch_A/READ_WRITE_DATA_SH
RX-S_CLOCK_SH: port RX-S_CLOCK_SH, sheet Busswitch_B/RX-S_CLOCK_SH, sheet Busswitch_A/RX-S_CLOCK_SH
RX-S_DATA_SH: port RX-S_DATA_SH, sheet Busswitch_B/RX-S_DATA_SH, sheet Busswitch_A/RX-S_DATA_SH
S0_SWA_DIGITAL: sheet Busswitch_A/S0_SWA_DIGITAL, sheet BusswitchControl/P0  [project net P0]
S0_SWB_DIGITAL: sheet Busswitch_B/S0_SWB_DIGITAL, sheet BusswitchControl/P5  [project net P5]
S1_SWA_DIGITAL: sheet Busswitch_A/S1_SWA_DIGITAL, sheet BusswitchControl/P1  [project net P1]
S1_SWB_DIGITAL: sheet Busswitch_B/S1_SWB_DIGITAL, sheet BusswitchControl/P6  [project net P6]
S2_SWA_DIGITAL: sheet Busswitch_A/S2_SWA_DIGITAL, sheet BusswitchControl/P2  [project net P2]
S2_SWB_DIGITAL: sheet Busswitch_B/S2_SWB_DIGITAL, sheet BusswitchControl/P7  [project net P7]
SCL: port SCL, sheet BusswitchControl/SCL
SDA: port SDA, sheet BusswitchControl/SDA
TX-S_CLOCK_SH: port TX-S_CLOCK_SH, sheet Busswitch_B/TX-S_CLOCK_SH, sheet Busswitch_A/TX-S_CLOCK_SH
TX-S_DATA_SH: port TX-S_DATA_SH, sheet Busswitch_B/TX-S_DATA_SH, sheet Busswitch_A/TX-S_DATA_SH
NetMUX1_3: port RX-S_DATA_SH2, sheet Busswitch_A/RX-S_DATA_SH2
NetMUX1_5: port TX-S_DATA_SH2, sheet Busswitch_A/TX-S_DATA_SH2
NetMUX1_7: port READ_WRITE_DATA_SH2, sheet Busswitch_A/READ_WRITE_DATA_SH2
NetMUX1_10: port RX-S_CLOCK_SH2, sheet Busswitch_A/RX-S_CLOCK_SH2
NetMUX1_12: port TX-S_CLOCK_SH2, sheet Busswitch_A/TX-S_CLOCK_SH2
NetMUX1_14: port READ_WRITE_CLOCK_SH2, sheet Busswitch_A/READ_WRITE_CLOCK_SH2

### Buses and harness runs
bus DB[0..12] = port DB[0..12]
bus DIG_IO_[0..29] = port DIG_IO_[0..29]
bus INCR_A[1..3] = port INCR_A[1..3]
bus INCR_B[1..3] = port INCR_B[1..3]
bus POUT_ADC[1..4] = port POUT_ADC[1..4]

### Notes on the sheet
- Title
- Revision:
- Design Engineer:
- Date:
- Project:
- Sheet
- of

### Library data of the parts
R143-R148 = R_0603: MPN: CRCW06030000Z0EAC; MF: Vishay; Supplier 1: Mouser; Supplier Part Number 1: 71-CRCW06030000Z0EAC
  R143-R145: Value: 10k
  R146-R148: Value: DNP